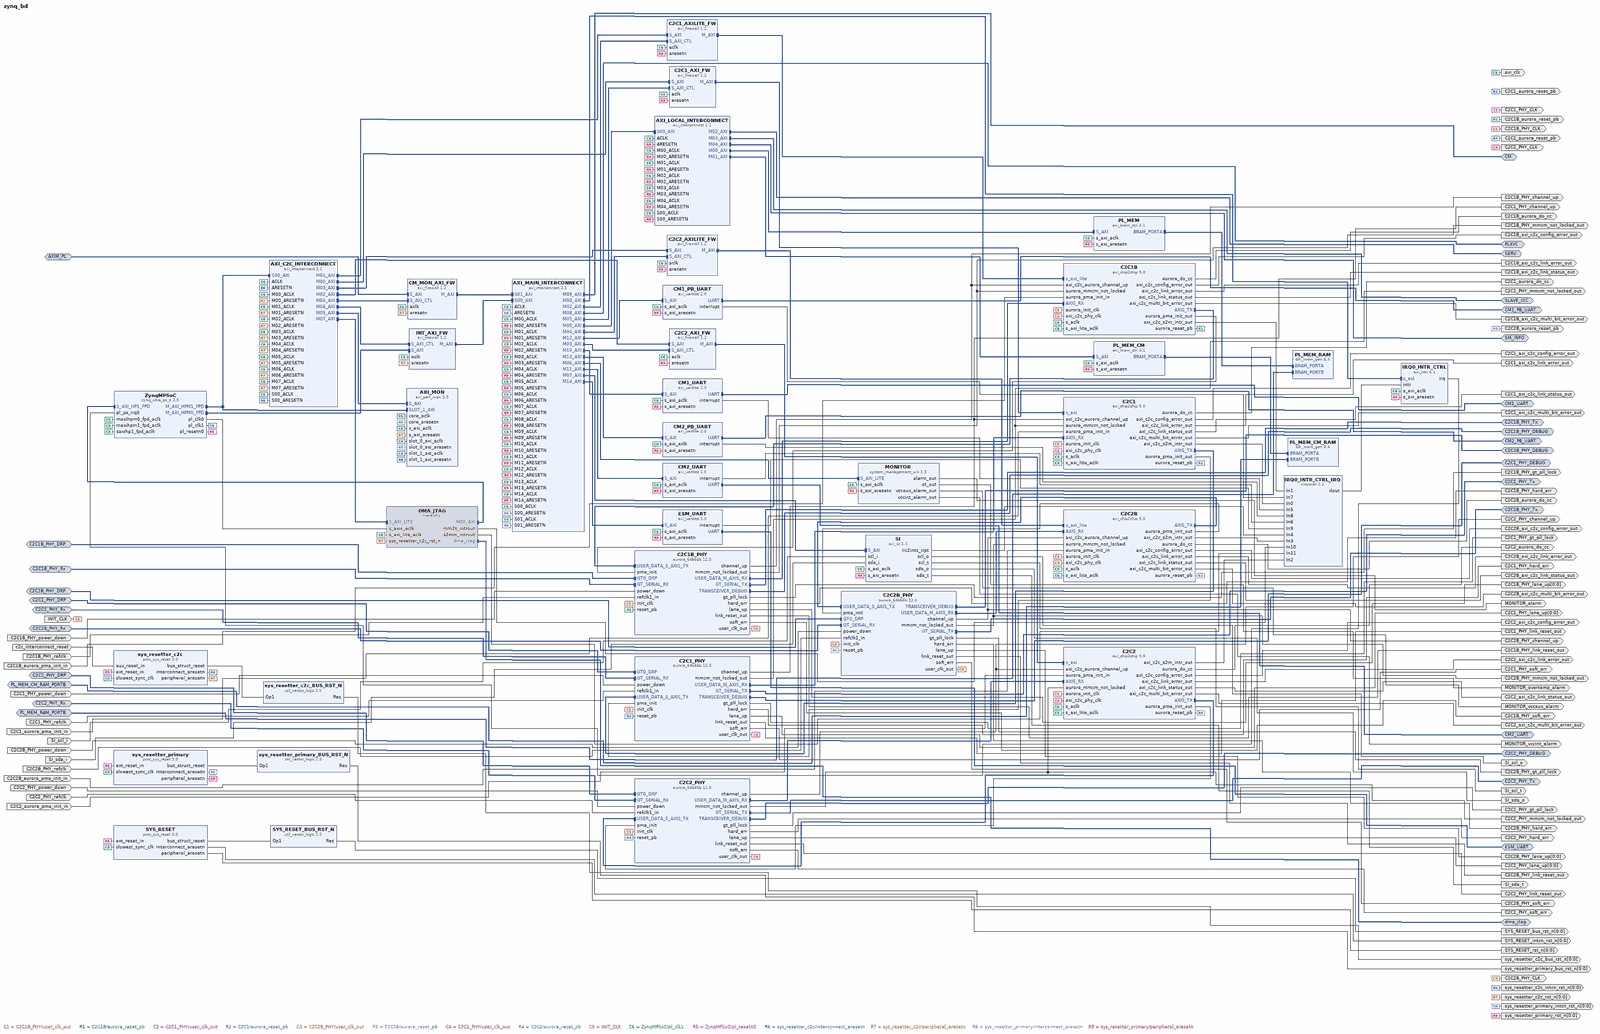
[diagram p0: block diagram of the top level, whole]
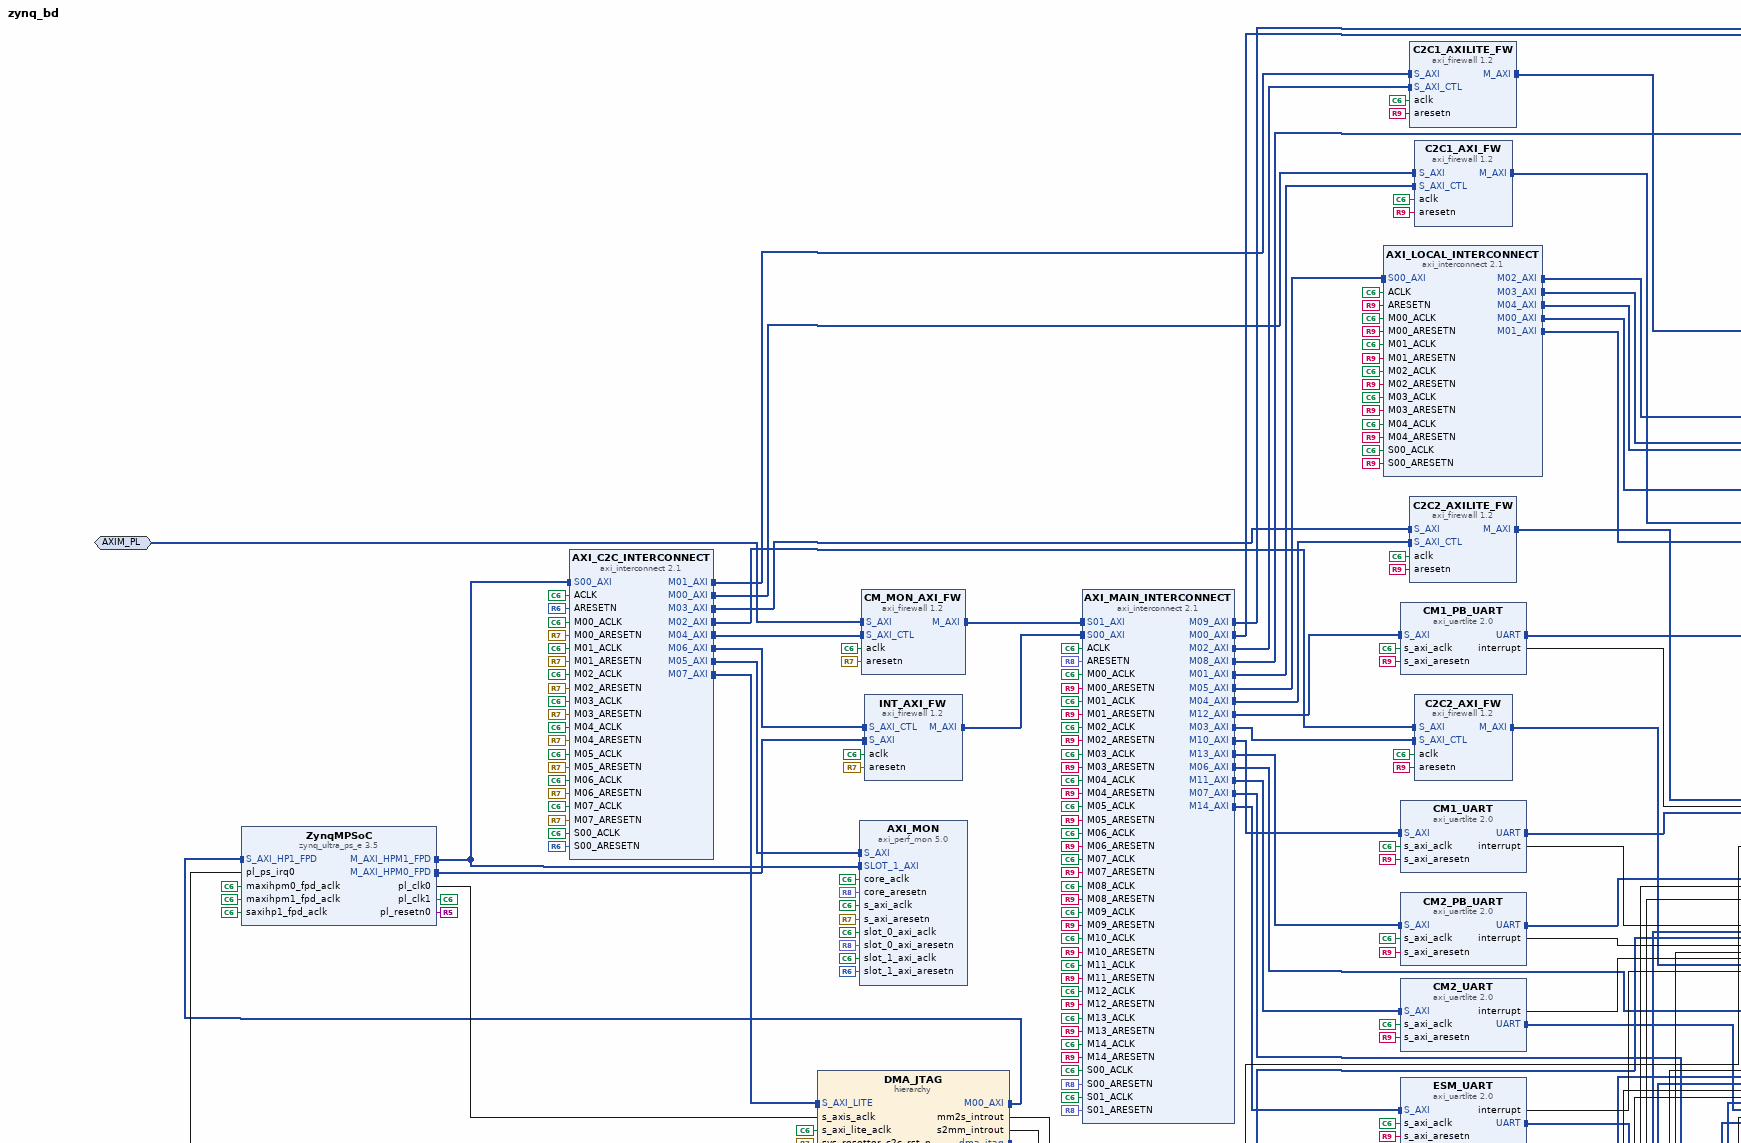
[diagram p1: block diagram of the top level, upper left part]
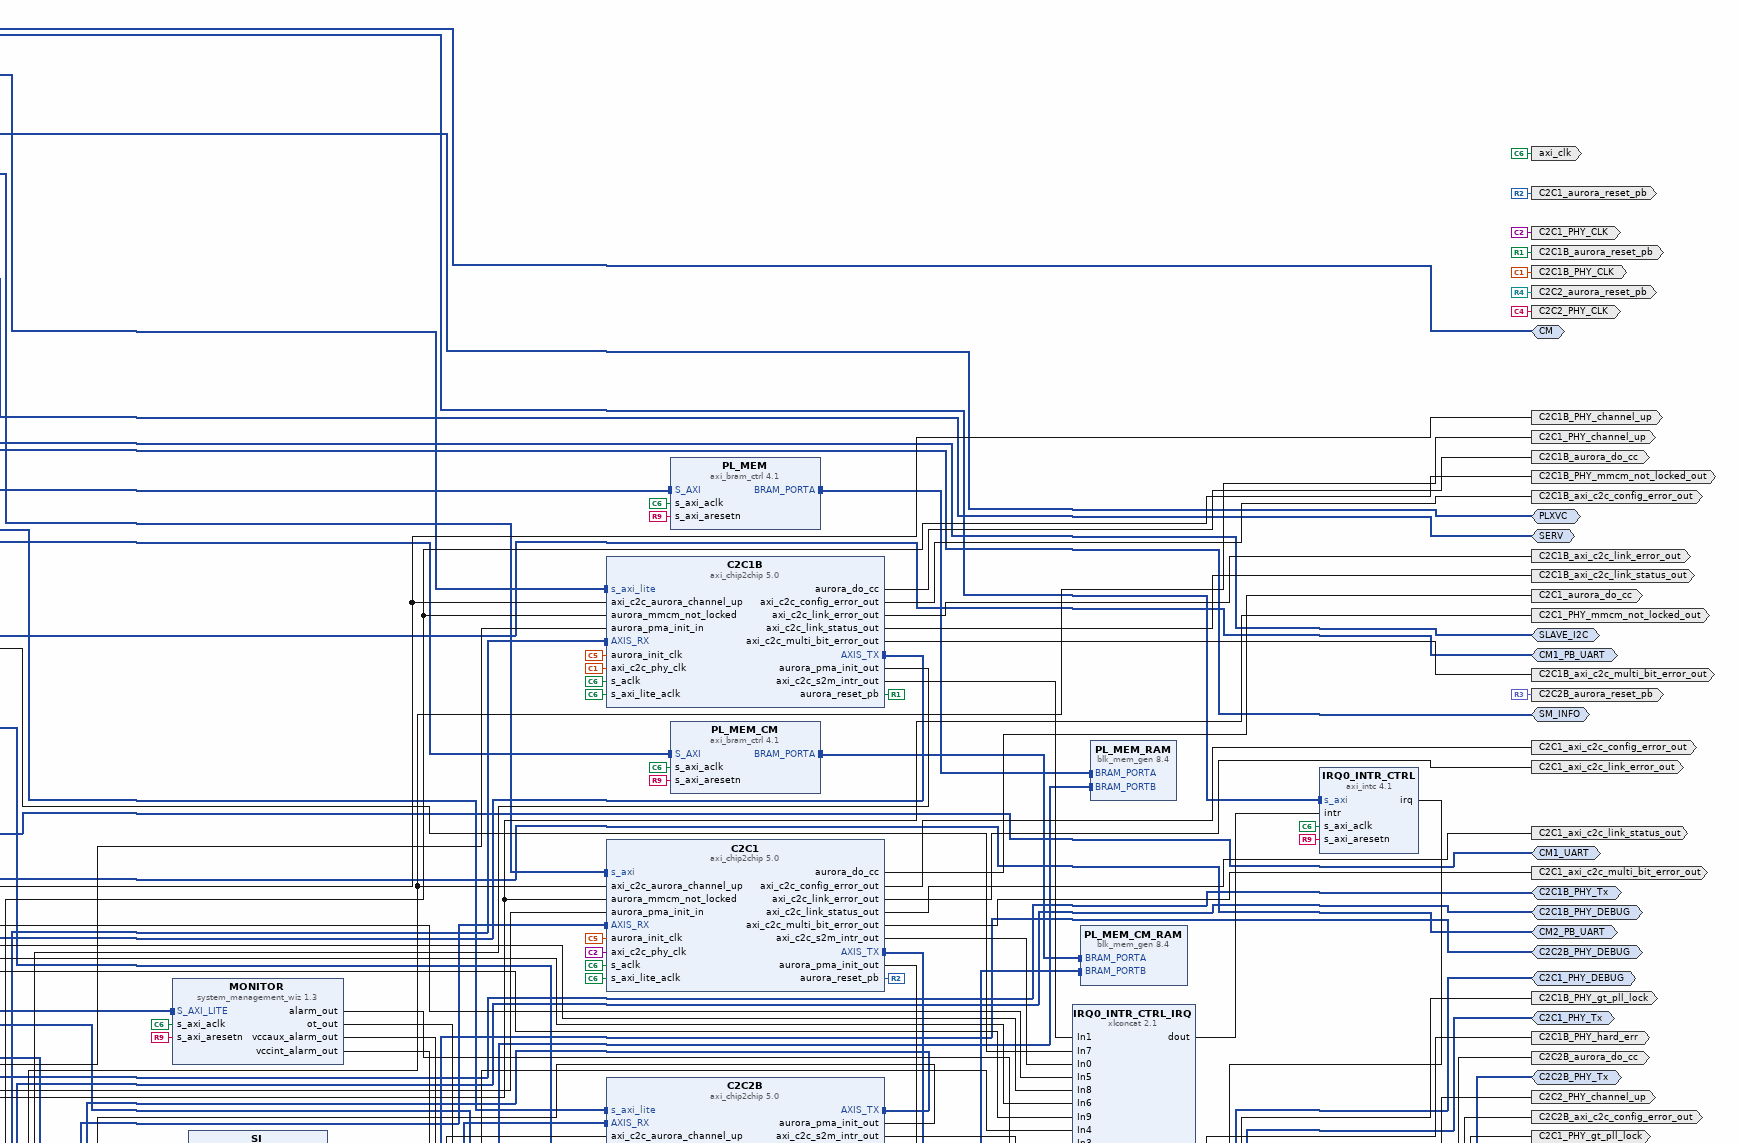
[diagram p2: block diagram of the top level, upper right part]
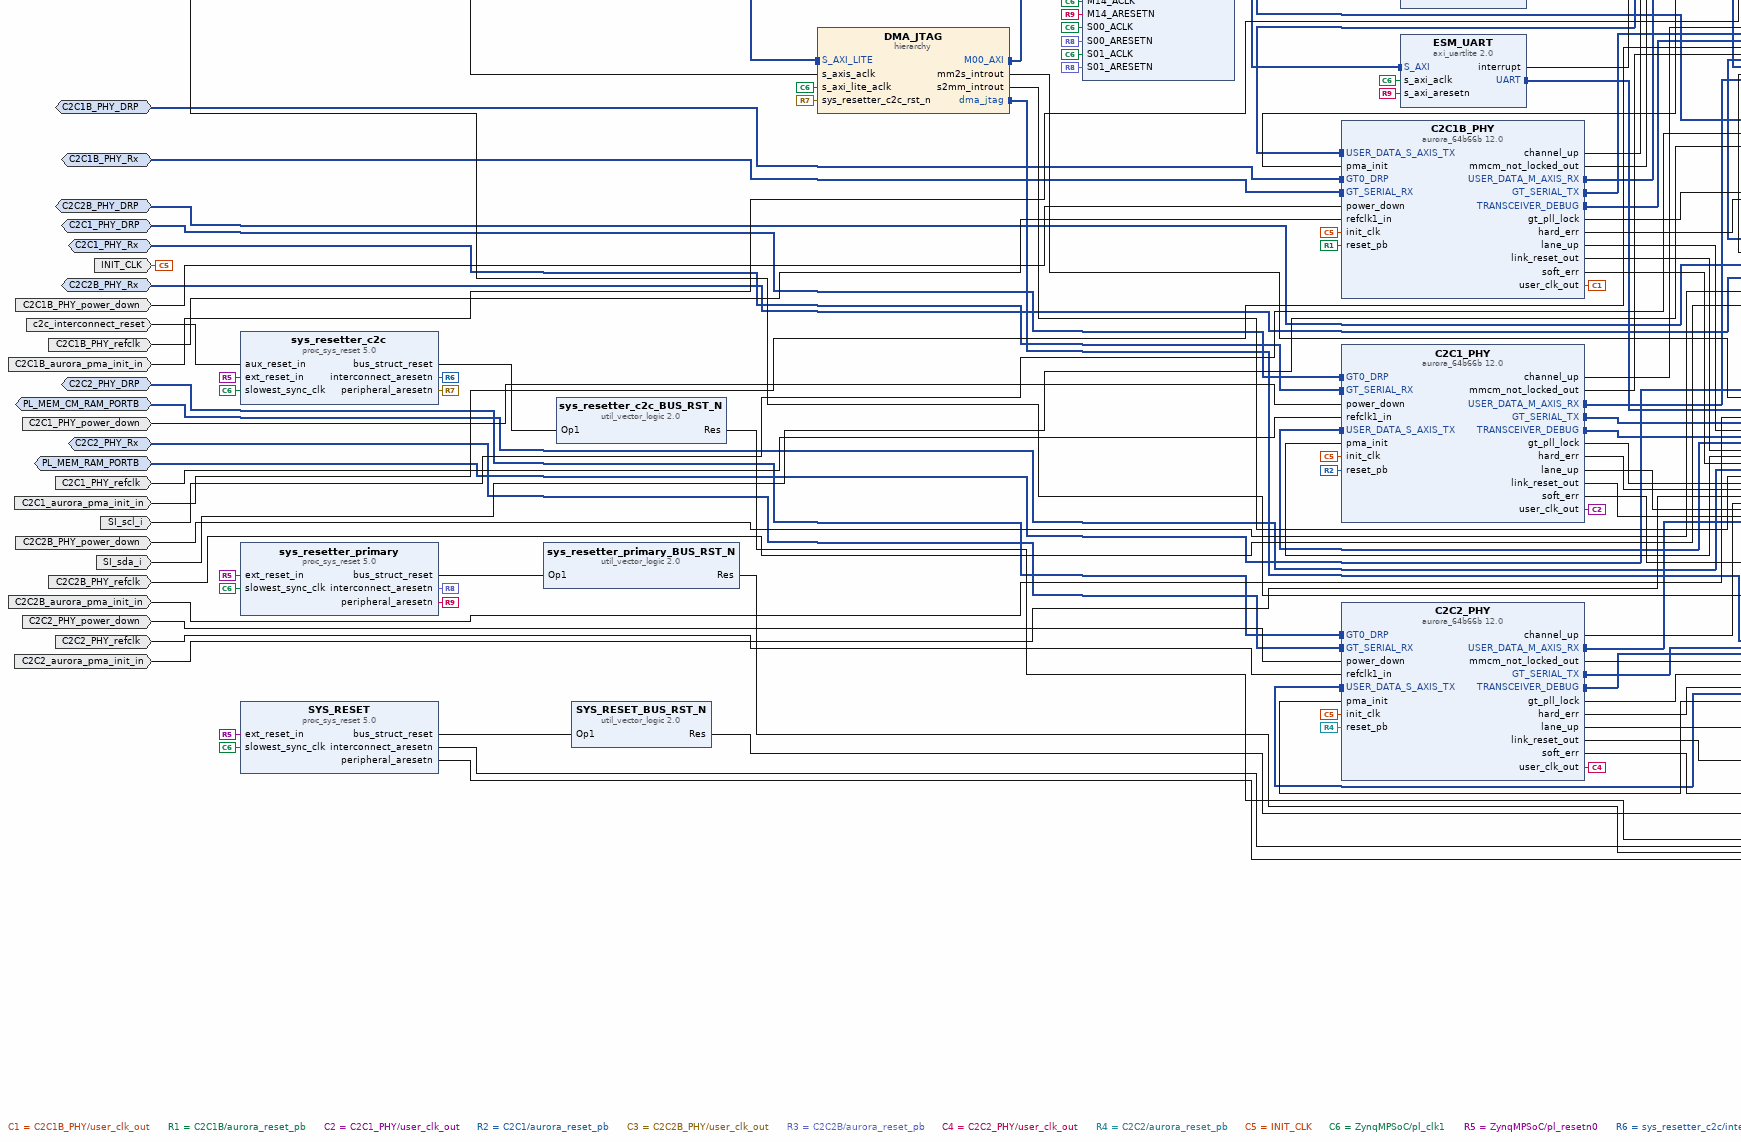
[diagram p3: block diagram of the top level, lower left part]
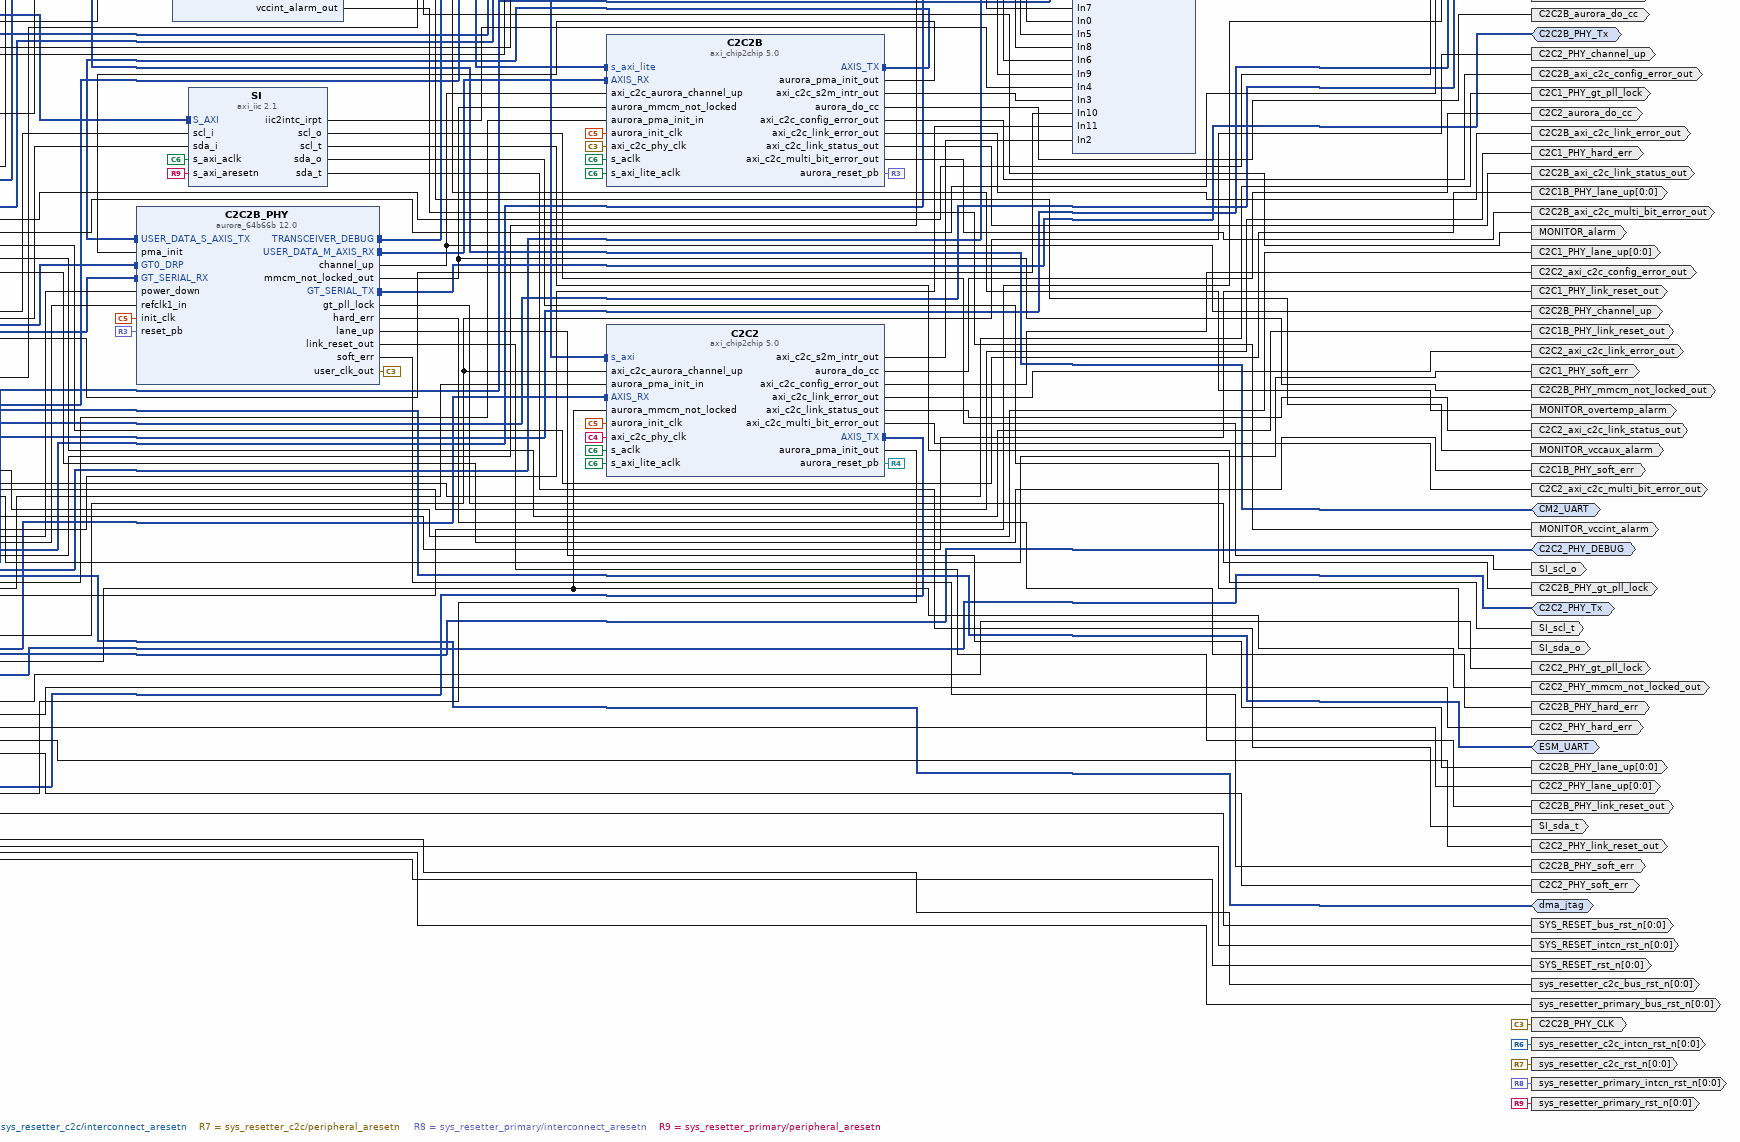
[diagram p4: block diagram of the top level, lower right part]
# Vivado block design zynq_bd, xczu7ev-fbvb900-2-i, Vivado 2023.2
create_bd_design zynq_bd

create_bd_intf_port -mode Slave -vlnv xilinx.com:interface:aximm_rtl:1.0 AXIM_PL
set_property -dict [list \
  CONFIG.ADDR_WIDTH 32 \
  CONFIG.ARUSER_WIDTH 0 \
  CONFIG.AWUSER_WIDTH 0 \
  CONFIG.BUSER_WIDTH 0 \
  CONFIG.DATA_WIDTH 32 \
  CONFIG.FREQ_HZ 49999500 \
  CONFIG.HAS_BRESP 1 \
  CONFIG.HAS_BURST 1 \
  CONFIG.HAS_CACHE 1 \
  CONFIG.HAS_LOCK 1 \
  CONFIG.HAS_PROT 1 \
  CONFIG.HAS_QOS 1 \
  CONFIG.HAS_REGION 1 \
  CONFIG.HAS_RRESP 1 \
  CONFIG.HAS_WSTRB 1 \
  CONFIG.ID_WIDTH 0 \
  CONFIG.MAX_BURST_LENGTH 1 \
  CONFIG.NUM_READ_OUTSTANDING 1 \
  CONFIG.NUM_READ_THREADS 1 \
  CONFIG.NUM_WRITE_OUTSTANDING 1 \
  CONFIG.NUM_WRITE_THREADS 1 \
  CONFIG.PROTOCOL AXI4LITE \
  CONFIG.READ_WRITE_MODE READ_WRITE \
  CONFIG.RUSER_BITS_PER_BYTE 0 \
  CONFIG.RUSER_WIDTH 0 \
  CONFIG.SUPPORTS_NARROW_BURST 0 \
  CONFIG.WUSER_BITS_PER_BYTE 0 \
  CONFIG.WUSER_WIDTH 0 \
] [get_bd_intf_ports AXIM_PL]
create_bd_intf_port -mode Slave -vlnv xilinx.com:interface:drp_rtl:1.0 C2C1_PHY_DRP
create_bd_intf_port -mode Slave -vlnv xilinx.com:display_aurora:GT_Serial_Transceiver_Pins_RX_rtl:1.0 C2C1_PHY_Rx
create_bd_intf_port -mode Master -vlnv xilinx.com:display_aurora:GT_Serial_Transceiver_Pins_TX_rtl:1.0 C2C1_PHY_Tx
create_bd_intf_port -mode Master -vlnv xilinx.com:display_aurora:transceiver_debug_rtl:1.0 C2C1_PHY_DEBUG
create_bd_intf_port -mode Slave -vlnv xilinx.com:interface:drp_rtl:1.0 C2C1B_PHY_DRP
create_bd_intf_port -mode Slave -vlnv xilinx.com:display_aurora:GT_Serial_Transceiver_Pins_RX_rtl:1.0 C2C1B_PHY_Rx
create_bd_intf_port -mode Master -vlnv xilinx.com:display_aurora:GT_Serial_Transceiver_Pins_TX_rtl:1.0 C2C1B_PHY_Tx
create_bd_intf_port -mode Master -vlnv xilinx.com:display_aurora:transceiver_debug_rtl:1.0 C2C1B_PHY_DEBUG
create_bd_intf_port -mode Slave -vlnv xilinx.com:interface:drp_rtl:1.0 C2C2_PHY_DRP
create_bd_intf_port -mode Slave -vlnv xilinx.com:display_aurora:GT_Serial_Transceiver_Pins_RX_rtl:1.0 C2C2_PHY_Rx
create_bd_intf_port -mode Master -vlnv xilinx.com:display_aurora:GT_Serial_Transceiver_Pins_TX_rtl:1.0 C2C2_PHY_Tx
create_bd_intf_port -mode Master -vlnv xilinx.com:display_aurora:transceiver_debug_rtl:1.0 C2C2_PHY_DEBUG
create_bd_intf_port -mode Slave -vlnv xilinx.com:interface:drp_rtl:1.0 C2C2B_PHY_DRP
create_bd_intf_port -mode Slave -vlnv xilinx.com:display_aurora:GT_Serial_Transceiver_Pins_RX_rtl:1.0 C2C2B_PHY_Rx
create_bd_intf_port -mode Master -vlnv xilinx.com:display_aurora:GT_Serial_Transceiver_Pins_TX_rtl:1.0 C2C2B_PHY_Tx
create_bd_intf_port -mode Master -vlnv xilinx.com:display_aurora:transceiver_debug_rtl:1.0 C2C2B_PHY_DEBUG
create_bd_intf_port -mode Slave -vlnv xilinx.com:interface:bram_rtl:1.0 PL_MEM_RAM_PORTB
set_property -dict {CONFIG.MASTER_TYPE BRAM_CTRL} [get_bd_intf_ports PL_MEM_RAM_PORTB]
create_bd_intf_port -mode Slave -vlnv xilinx.com:interface:bram_rtl:1.0 PL_MEM_CM_RAM_PORTB
set_property -dict {CONFIG.MASTER_TYPE BRAM_CTRL} [get_bd_intf_ports PL_MEM_CM_RAM_PORTB]
create_bd_intf_port -mode Master -vlnv xilinx.com:interface:aximm_rtl:1.0 SERV
set_property -dict [list \
  CONFIG.ADDR_WIDTH 32 \
  CONFIG.DATA_WIDTH 32 \
  CONFIG.FREQ_HZ 49999500 \
  CONFIG.NUM_READ_OUTSTANDING 2 \
  CONFIG.NUM_WRITE_OUTSTANDING 2 \
  CONFIG.PROTOCOL AXI4LITE \
] [get_bd_intf_ports SERV]
create_bd_intf_port -mode Master -vlnv xilinx.com:interface:aximm_rtl:1.0 SLAVE_I2C
set_property -dict [list \
  CONFIG.ADDR_WIDTH 32 \
  CONFIG.DATA_WIDTH 32 \
  CONFIG.FREQ_HZ 49999500 \
  CONFIG.NUM_READ_OUTSTANDING 2 \
  CONFIG.NUM_WRITE_OUTSTANDING 2 \
  CONFIG.PROTOCOL AXI4LITE \
] [get_bd_intf_ports SLAVE_I2C]
create_bd_intf_port -mode Master -vlnv xilinx.com:interface:aximm_rtl:1.0 SM_INFO
set_property -dict [list \
  CONFIG.ADDR_WIDTH 32 \
  CONFIG.DATA_WIDTH 32 \
  CONFIG.FREQ_HZ 49999500 \
  CONFIG.NUM_READ_OUTSTANDING 2 \
  CONFIG.NUM_WRITE_OUTSTANDING 2 \
  CONFIG.PROTOCOL AXI4LITE \
] [get_bd_intf_ports SM_INFO]
create_bd_intf_port -mode Master -vlnv xilinx.com:interface:aximm_rtl:1.0 PLXVC
set_property -dict [list \
  CONFIG.ADDR_WIDTH 32 \
  CONFIG.DATA_WIDTH 32 \
  CONFIG.FREQ_HZ 49999500 \
  CONFIG.NUM_READ_OUTSTANDING 2 \
  CONFIG.NUM_WRITE_OUTSTANDING 2 \
  CONFIG.PROTOCOL AXI4LITE \
] [get_bd_intf_ports PLXVC]
create_bd_intf_port -mode Master -vlnv xilinx.com:interface:aximm_rtl:1.0 CM
set_property -dict [list \
  CONFIG.ADDR_WIDTH 32 \
  CONFIG.DATA_WIDTH 32 \
  CONFIG.FREQ_HZ 49999500 \
  CONFIG.NUM_READ_OUTSTANDING 2 \
  CONFIG.NUM_WRITE_OUTSTANDING 2 \
  CONFIG.PROTOCOL AXI4LITE \
] [get_bd_intf_ports CM]
create_bd_intf_port -mode Master -vlnv xilinx.com:interface:uart_rtl:1.0 CM1_UART
create_bd_intf_port -mode Master -vlnv xilinx.com:interface:uart_rtl:1.0 CM2_UART
create_bd_intf_port -mode Master -vlnv xilinx.com:interface:uart_rtl:1.0 CM1_PB_UART
create_bd_intf_port -mode Master -vlnv xilinx.com:interface:uart_rtl:1.0 CM2_PB_UART
create_bd_intf_port -mode Master -vlnv xilinx.com:interface:uart_rtl:1.0 ESM_UART
create_bd_intf_port -mode Master -vlnv xilinx.com:interface:jtag_rtl:2.0 dma_jtag
create_bd_port -dir O -type clk axi_clk
create_bd_port -dir O -from 0 -to 0 sys_resetter_primary_bus_rst_n
create_bd_port -dir O -from 0 -to 0 -type rst sys_resetter_primary_intcn_rst_n
create_bd_port -dir O -from 0 -to 0 -type rst sys_resetter_primary_rst_n
create_bd_port -dir I -type rst c2c_interconnect_reset
set_property -dict {CONFIG.POLARITY ACTIVE_HIGH} [get_bd_ports c2c_interconnect_reset]
create_bd_port -dir O -from 0 -to 0 sys_resetter_c2c_bus_rst_n
create_bd_port -dir O -from 0 -to 0 -type rst sys_resetter_c2c_intcn_rst_n
create_bd_port -dir O -from 0 -to 0 -type rst sys_resetter_c2c_rst_n
create_bd_port -dir I -type clk INIT_CLK
set_property -dict {CONFIG.FREQ_HZ 50000000} [get_bd_ports INIT_CLK]
create_bd_port -dir O -from 0 -to 0 SYS_RESET_bus_rst_n
create_bd_port -dir O -from 0 -to 0 -type rst SYS_RESET_intcn_rst_n
create_bd_port -dir O -from 0 -to 0 -type rst SYS_RESET_rst_n
create_bd_port -dir I -type rst C2C1_aurora_pma_init_in
set_property -dict {CONFIG.POLARITY ACTIVE_HIGH} [get_bd_ports C2C1_aurora_pma_init_in]
create_bd_port -dir O -type rst C2C1_aurora_reset_pb
create_bd_port -dir O C2C1_aurora_do_cc
create_bd_port -dir O C2C1_axi_c2c_config_error_out
create_bd_port -dir O C2C1_axi_c2c_link_status_out
create_bd_port -dir O C2C1_axi_c2c_multi_bit_error_out
create_bd_port -dir O C2C1_axi_c2c_link_error_out
create_bd_port -dir I -type clk C2C1_PHY_refclk
set_property -dict {CONFIG.PHASE 0} [get_bd_ports C2C1_PHY_refclk]
create_bd_port -dir I -type rst C2C1_PHY_power_down
create_bd_port -dir O C2C1_PHY_gt_pll_lock
create_bd_port -dir O C2C1_PHY_hard_err
create_bd_port -dir O C2C1_PHY_soft_err
create_bd_port -dir O -from 0 -to 0 C2C1_PHY_lane_up
create_bd_port -dir O C2C1_PHY_mmcm_not_locked_out
create_bd_port -dir O -type rst C2C1_PHY_link_reset_out
create_bd_port -dir O C2C1_PHY_channel_up
create_bd_port -dir O -type clk C2C1_PHY_CLK
create_bd_port -dir I -type rst C2C1B_aurora_pma_init_in
set_property -dict {CONFIG.POLARITY ACTIVE_HIGH} [get_bd_ports C2C1B_aurora_pma_init_in]
create_bd_port -dir O -type rst C2C1B_aurora_reset_pb
create_bd_port -dir O C2C1B_aurora_do_cc
create_bd_port -dir O C2C1B_axi_c2c_config_error_out
create_bd_port -dir O C2C1B_axi_c2c_link_status_out
create_bd_port -dir O C2C1B_axi_c2c_multi_bit_error_out
create_bd_port -dir O C2C1B_axi_c2c_link_error_out
create_bd_port -dir I -type clk C2C1B_PHY_refclk
set_property -dict {CONFIG.PHASE 0} [get_bd_ports C2C1B_PHY_refclk]
create_bd_port -dir I -type rst C2C1B_PHY_power_down
create_bd_port -dir O C2C1B_PHY_gt_pll_lock
create_bd_port -dir O C2C1B_PHY_hard_err
create_bd_port -dir O C2C1B_PHY_soft_err
create_bd_port -dir O -from 0 -to 0 C2C1B_PHY_lane_up
create_bd_port -dir O C2C1B_PHY_mmcm_not_locked_out
create_bd_port -dir O -type rst C2C1B_PHY_link_reset_out
create_bd_port -dir O C2C1B_PHY_channel_up
create_bd_port -dir O -type clk C2C1B_PHY_CLK
create_bd_port -dir I -type rst C2C2_aurora_pma_init_in
set_property -dict {CONFIG.POLARITY ACTIVE_HIGH} [get_bd_ports C2C2_aurora_pma_init_in]
create_bd_port -dir O -type rst C2C2_aurora_reset_pb
create_bd_port -dir O C2C2_aurora_do_cc
create_bd_port -dir O C2C2_axi_c2c_config_error_out
create_bd_port -dir O C2C2_axi_c2c_link_status_out
create_bd_port -dir O C2C2_axi_c2c_multi_bit_error_out
create_bd_port -dir O C2C2_axi_c2c_link_error_out
create_bd_port -dir I -type clk C2C2_PHY_refclk
set_property -dict {CONFIG.PHASE 0} [get_bd_ports C2C2_PHY_refclk]
create_bd_port -dir I -type rst C2C2_PHY_power_down
create_bd_port -dir O C2C2_PHY_gt_pll_lock
create_bd_port -dir O C2C2_PHY_hard_err
create_bd_port -dir O C2C2_PHY_soft_err
create_bd_port -dir O -from 0 -to 0 C2C2_PHY_lane_up
create_bd_port -dir O C2C2_PHY_mmcm_not_locked_out
create_bd_port -dir O -type rst C2C2_PHY_link_reset_out
create_bd_port -dir O C2C2_PHY_channel_up
create_bd_port -dir O -type clk C2C2_PHY_CLK
create_bd_port -dir I -type rst C2C2B_aurora_pma_init_in
set_property -dict {CONFIG.POLARITY ACTIVE_HIGH} [get_bd_ports C2C2B_aurora_pma_init_in]
create_bd_port -dir O -type rst C2C2B_aurora_reset_pb
create_bd_port -dir O C2C2B_aurora_do_cc
create_bd_port -dir O C2C2B_axi_c2c_config_error_out
create_bd_port -dir O C2C2B_axi_c2c_link_status_out
create_bd_port -dir O C2C2B_axi_c2c_multi_bit_error_out
create_bd_port -dir O C2C2B_axi_c2c_link_error_out
create_bd_port -dir I -type clk C2C2B_PHY_refclk
set_property -dict {CONFIG.PHASE 0} [get_bd_ports C2C2B_PHY_refclk]
create_bd_port -dir I -type rst C2C2B_PHY_power_down
create_bd_port -dir O C2C2B_PHY_gt_pll_lock
create_bd_port -dir O C2C2B_PHY_hard_err
create_bd_port -dir O C2C2B_PHY_soft_err
create_bd_port -dir O -from 0 -to 0 C2C2B_PHY_lane_up
create_bd_port -dir O C2C2B_PHY_mmcm_not_locked_out
create_bd_port -dir O -type rst C2C2B_PHY_link_reset_out
create_bd_port -dir O C2C2B_PHY_channel_up
create_bd_port -dir O -type clk C2C2B_PHY_CLK
create_bd_port -dir O MONITOR_alarm
create_bd_port -dir O MONITOR_vccint_alarm
create_bd_port -dir O MONITOR_vccaux_alarm
create_bd_port -dir O MONITOR_overtemp_alarm
create_bd_port -dir I SI_scl_i
create_bd_port -dir I SI_sda_i
create_bd_port -dir O SI_sda_o
create_bd_port -dir O SI_scl_o
create_bd_port -dir O SI_scl_t
create_bd_port -dir O SI_sda_t

create_bd_cell -type ip -vlnv xilinx.com:ip:zynq_ultra_ps_e:3.5 ZynqMPSoC
set_property -dict [list \
  CONFIG.CAN0_BOARD_INTERFACE custom \
  CONFIG.CAN1_BOARD_INTERFACE custom \
  CONFIG.CSU_BOARD_INTERFACE custom \
  CONFIG.DP_BOARD_INTERFACE custom \
  CONFIG.GEM0_BOARD_INTERFACE custom \
  CONFIG.GEM1_BOARD_INTERFACE custom \
  CONFIG.GEM2_BOARD_INTERFACE custom \
  CONFIG.GEM3_BOARD_INTERFACE custom \
  CONFIG.GPIO_BOARD_INTERFACE custom \
  CONFIG.IIC0_BOARD_INTERFACE custom \
  CONFIG.IIC1_BOARD_INTERFACE custom \
  CONFIG.NAND_BOARD_INTERFACE custom \
  CONFIG.PCIE_BOARD_INTERFACE custom \
  CONFIG.PJTAG_BOARD_INTERFACE custom \
  CONFIG.PMU_BOARD_INTERFACE custom \
  CONFIG.PSU_BANK_0_IO_STANDARD LVCMOS18 \
  CONFIG.PSU_BANK_1_IO_STANDARD LVCMOS33 \
  CONFIG.PSU_BANK_2_IO_STANDARD LVCMOS18 \
  CONFIG.PSU_BANK_3_IO_STANDARD LVCMOS33 \
  CONFIG.PSU_USB3__DUAL_CLOCK_ENABLE 0 \
  CONFIG.PSU__CAN1__PERIPHERAL__ENABLE 0 \
  CONFIG.PSU__CRF_APB__ACPU_CTRL__FREQMHZ 1200 \
  CONFIG.PSU__CRF_APB__ACPU_CTRL__SRCSEL APLL \
  CONFIG.PSU__CRF_APB__APLL_CTRL__SRCSEL PSS_REF_CLK \
  CONFIG.PSU__CRF_APB__DBG_FPD_CTRL__FREQMHZ 250 \
  CONFIG.PSU__CRF_APB__DBG_FPD_CTRL__SRCSEL IOPLL \
  CONFIG.PSU__CRF_APB__DBG_TRACE_CTRL__FREQMHZ 250 \
  CONFIG.PSU__CRF_APB__DBG_TRACE_CTRL__SRCSEL IOPLL \
  CONFIG.PSU__CRF_APB__DBG_TSTMP_CTRL__FREQMHZ 250 \
  CONFIG.PSU__CRF_APB__DBG_TSTMP_CTRL__SRCSEL IOPLL \
  CONFIG.PSU__CRF_APB__DDR_CTRL__FREQMHZ 1200 \
  CONFIG.PSU__CRF_APB__DDR_CTRL__SRCSEL DPLL \
  CONFIG.PSU__CRF_APB__DPDMA_REF_CTRL__FREQMHZ 600 \
  CONFIG.PSU__CRF_APB__DPDMA_REF_CTRL__SRCSEL DPLL \
  CONFIG.PSU__CRF_APB__DPLL_CTRL__SRCSEL PSS_REF_CLK \
  CONFIG.PSU__CRF_APB__DP_AUDIO_REF_CTRL__SRCSEL VPLL \
  CONFIG.PSU__CRF_APB__DP_STC_REF_CTRL__SRCSEL VPLL \
  CONFIG.PSU__CRF_APB__DP_VIDEO_REF_CTRL__SRCSEL DPLL \
  CONFIG.PSU__CRF_APB__GDMA_REF_CTRL__FREQMHZ 600 \
  CONFIG.PSU__CRF_APB__GDMA_REF_CTRL__SRCSEL DPLL \
  CONFIG.PSU__CRF_APB__GPU_REF_CTRL__FREQMHZ 600 \
  CONFIG.PSU__CRF_APB__GPU_REF_CTRL__SRCSEL DPLL \
  CONFIG.PSU__CRF_APB__TOPSW_LSBUS_CTRL__FREQMHZ 100 \
  CONFIG.PSU__CRF_APB__TOPSW_LSBUS_CTRL__SRCSEL IOPLL \
  CONFIG.PSU__CRF_APB__TOPSW_MAIN_CTRL__FREQMHZ 500 \
  CONFIG.PSU__CRF_APB__TOPSW_MAIN_CTRL__SRCSEL VPLL \
  CONFIG.PSU__CRF_APB__VPLL_CTRL__SRCSEL PSS_REF_CLK \
  CONFIG.PSU__CRL_APB__ADMA_REF_CTRL__FREQMHZ 500 \
  CONFIG.PSU__CRL_APB__ADMA_REF_CTRL__SRCSEL RPLL \
  CONFIG.PSU__CRL_APB__CAN1_REF_CTRL__FREQMHZ 100 \
  CONFIG.PSU__CRL_APB__CAN1_REF_CTRL__SRCSEL IOPLL \
  CONFIG.PSU__CRL_APB__CPU_R5_CTRL__FREQMHZ 500 \
  CONFIG.PSU__CRL_APB__CPU_R5_CTRL__SRCSEL RPLL \
  CONFIG.PSU__CRL_APB__DBG_LPD_CTRL__FREQMHZ 250 \
  CONFIG.PSU__CRL_APB__DBG_LPD_CTRL__SRCSEL IOPLL \
  CONFIG.PSU__CRL_APB__GEM3_REF_CTRL__FREQMHZ 125 \
  CONFIG.PSU__CRL_APB__GEM3_REF_CTRL__SRCSEL IOPLL \
  CONFIG.PSU__CRL_APB__I2C0_REF_CTRL__FREQMHZ 100 \
  CONFIG.PSU__CRL_APB__I2C0_REF_CTRL__SRCSEL IOPLL \
  CONFIG.PSU__CRL_APB__I2C1_REF_CTRL__FREQMHZ 100 \
  CONFIG.PSU__CRL_APB__I2C1_REF_CTRL__SRCSEL IOPLL \
  CONFIG.PSU__CRL_APB__IOPLL_CTRL__SRCSEL PSS_REF_CLK \
  CONFIG.PSU__CRL_APB__IOU_SWITCH_CTRL__FREQMHZ 250 \
  CONFIG.PSU__CRL_APB__IOU_SWITCH_CTRL__SRCSEL RPLL \
  CONFIG.PSU__CRL_APB__LPD_LSBUS_CTRL__FREQMHZ 100 \
  CONFIG.PSU__CRL_APB__LPD_LSBUS_CTRL__SRCSEL IOPLL \
  CONFIG.PSU__CRL_APB__LPD_SWITCH_CTRL__FREQMHZ 500 \
  CONFIG.PSU__CRL_APB__LPD_SWITCH_CTRL__SRCSEL RPLL \
  CONFIG.PSU__CRL_APB__PCAP_CTRL__FREQMHZ 200 \
  CONFIG.PSU__CRL_APB__PCAP_CTRL__SRCSEL IOPLL \
  CONFIG.PSU__CRL_APB__PL0_REF_CTRL__FREQMHZ 80 \
  CONFIG.PSU__CRL_APB__PL0_REF_CTRL__SRCSEL DPLL \
  CONFIG.PSU__CRL_APB__PL1_REF_CTRL__FREQMHZ 50 \
  CONFIG.PSU__CRL_APB__QSPI_REF_CTRL__FREQMHZ 50 \
  CONFIG.PSU__CRL_APB__QSPI_REF_CTRL__SRCSEL IOPLL \
  CONFIG.PSU__CRL_APB__RPLL_CTRL__SRCSEL PSS_REF_CLK \
  CONFIG.PSU__CRL_APB__SDIO1_REF_CTRL__FREQMHZ 50 \
  CONFIG.PSU__CRL_APB__SDIO1_REF_CTRL__SRCSEL IOPLL \
  CONFIG.PSU__CRL_APB__TIMESTAMP_REF_CTRL__FREQMHZ 100 \
  CONFIG.PSU__CRL_APB__TIMESTAMP_REF_CTRL__SRCSEL PSS_REF_CLK \
  CONFIG.PSU__CRL_APB__UART0_REF_CTRL__FREQMHZ 100 \
  CONFIG.PSU__CRL_APB__UART0_REF_CTRL__SRCSEL IOPLL \
  CONFIG.PSU__CRL_APB__UART1_REF_CTRL__FREQMHZ 100 \
  CONFIG.PSU__CRL_APB__UART1_REF_CTRL__SRCSEL IOPLL \
  CONFIG.PSU__CRL_APB__USB0_BUS_REF_CTRL__FREQMHZ 250 \
  CONFIG.PSU__CRL_APB__USB0_BUS_REF_CTRL__SRCSEL IOPLL \
  CONFIG.PSU__CRL_APB__USB3_DUAL_REF_CTRL__FREQMHZ 20 \
  CONFIG.PSU__CRL_APB__USB3_DUAL_REF_CTRL__SRCSEL IOPLL \
  CONFIG.PSU__CRL_APB__USB3__ENABLE 0 \
  CONFIG.PSU__CSUPMU__PERIPHERAL__VALID 0 \
  CONFIG.PSU__DDRC__BUS_WIDTH {64 Bit} \
  CONFIG.PSU__DDRC__COMPONENTS Components \
  CONFIG.PSU__DDRC__DEVICE_CAPACITY {8192 MBits} \
  CONFIG.PSU__DDRC__DRAM_WIDTH {16 Bits} \
  CONFIG.PSU__DDRC__ECC Enabled \
  CONFIG.PSU__DDRC__MEMORY_TYPE {DDR 4} \
  CONFIG.PSU__DDRC__SPEED_BIN DDR4_2400T \
  CONFIG.PSU__DDR_HIGH_ADDRESS_GUI_ENABLE 1 \
  CONFIG.PSU__DDR__INTERFACE__FREQMHZ 600.000 \
  CONFIG.PSU__DEVICE_TYPE EV \
  CONFIG.PSU__DISPLAYPORT__PERIPHERAL__ENABLE 0 \
  CONFIG.PSU__DLL__ISUSED 1 \
  CONFIG.PSU__ENET0__GRP_MDIO__ENABLE 1 \
  CONFIG.PSU__ENET0__GRP_MDIO__IO {MIO 76 .. 77} \
  CONFIG.PSU__ENET0__PERIPHERAL__ENABLE 1 \
  CONFIG.PSU__ENET0__PERIPHERAL__IO {MIO 26 .. 37} \
  CONFIG.PSU__ENET3__FIFO__ENABLE 0 \
  CONFIG.PSU__ENET3__GRP_MDIO__ENABLE 0 \
  CONFIG.PSU__ENET3__PERIPHERAL__ENABLE 1 \
  CONFIG.PSU__ENET3__PERIPHERAL__IO {MIO 64 .. 75} \
  CONFIG.PSU__ENET3__PTP__ENABLE 0 \
  CONFIG.PSU__ENET3__TSU__ENABLE 0 \
  CONFIG.PSU__FPD_SLCR__WDT1__FREQMHZ 100 \
  CONFIG.PSU__FPGA_PL0_ENABLE 1 \
  CONFIG.PSU__FPGA_PL1_ENABLE 1 \
  CONFIG.PSU__GEM3_COHERENCY 0 \
  CONFIG.PSU__GEM3_ROUTE_THROUGH_FPD 0 \
  CONFIG.PSU__GEM__TSU__ENABLE 0 \
  CONFIG.PSU__GPIO0_MIO__IO {MIO 0 .. 25} \
  CONFIG.PSU__GPIO0_MIO__PERIPHERAL__ENABLE 1 \
  CONFIG.PSU__GPIO1_MIO__IO {MIO 26 .. 51} \
  CONFIG.PSU__GPIO1_MIO__PERIPHERAL__ENABLE 1 \
  CONFIG.PSU__I2C0__PERIPHERAL__ENABLE 1 \
  CONFIG.PSU__I2C0__PERIPHERAL__IO {MIO 10 .. 11} \
  CONFIG.PSU__I2C1__PERIPHERAL__ENABLE 0 \
  CONFIG.PSU__IOU_SLCR__IOU_TTC_APB_CLK__TTC0_SEL APB \
  CONFIG.PSU__IOU_SLCR__IOU_TTC_APB_CLK__TTC1_SEL APB \
  CONFIG.PSU__IOU_SLCR__IOU_TTC_APB_CLK__TTC2_SEL APB \
  CONFIG.PSU__IOU_SLCR__IOU_TTC_APB_CLK__TTC3_SEL APB \
  CONFIG.PSU__IOU_SLCR__TTC1__FREQMHZ 100 \
  CONFIG.PSU__IOU_SLCR__TTC2__FREQMHZ 100 \
  CONFIG.PSU__IOU_SLCR__TTC3__FREQMHZ 100 \
  CONFIG.PSU__IOU_SLCR__WDT0__FREQMHZ 100 \
  CONFIG.PSU__LPD_SLCR__CSUPMU__FREQMHZ 100 \
  CONFIG.PSU__MAXIGP0__DATA_WIDTH 32 \
  CONFIG.PSU__MAXIGP1__DATA_WIDTH 32 \
  CONFIG.PSU__OVERRIDE_HPX_QOS 0 \
  CONFIG.PSU__OVERRIDE__BASIC_CLOCK 0 \
  CONFIG.PSU__PMU__PERIPHERAL__ENABLE 0 \
  CONFIG.PSU__PRESET_APPLIED 0 \
  CONFIG.PSU__PSS_REF_CLK__FREQMHZ 33.333 \
  CONFIG.PSU__QSPI_COHERENCY 0 \
  CONFIG.PSU__QSPI_ROUTE_THROUGH_FPD 0 \
  CONFIG.PSU__QSPI__GRP_FBCLK__ENABLE 1 \
  CONFIG.PSU__QSPI__GRP_FBCLK__IO {MIO 6} \
  CONFIG.PSU__QSPI__PERIPHERAL__DATA_MODE x4 \
  CONFIG.PSU__QSPI__PERIPHERAL__ENABLE 1 \
  CONFIG.PSU__QSPI__PERIPHERAL__IO {MIO 0 .. 5} \
  CONFIG.PSU__QSPI__PERIPHERAL__MODE Single \
  CONFIG.PSU__SATA__LANE0__ENABLE 1 \
  CONFIG.PSU__SATA__LANE0__IO {GT Lane2} \
  CONFIG.PSU__SATA__LANE1__ENABLE 0 \
  CONFIG.PSU__SATA__PERIPHERAL__ENABLE 1 \
  CONFIG.PSU__SATA__REF_CLK_FREQ 125 \
  CONFIG.PSU__SATA__REF_CLK_SEL {Ref Clk0} \
  CONFIG.PSU__SD0__CLK_200_SDR_OTAP_DLY 0x3 \
  CONFIG.PSU__SD0__CLK_50_DDR_ITAP_DLY 0x12 \
  CONFIG.PSU__SD0__CLK_50_DDR_OTAP_DLY 0x6 \
  CONFIG.PSU__SD0__CLK_50_SDR_ITAP_DLY 0x15 \
  CONFIG.PSU__SD0__CLK_50_SDR_OTAP_DLY 0x6 \
  CONFIG.PSU__SD0__DATA_TRANSFER_MODE 8Bit \
  CONFIG.PSU__SD0__PERIPHERAL__ENABLE 1 \
  CONFIG.PSU__SD0__PERIPHERAL__IO {MIO 13 .. 22} \
  CONFIG.PSU__SD0__SLOT_TYPE eMMC \
  CONFIG.PSU__SD1_COHERENCY 0 \
  CONFIG.PSU__SD1_ROUTE_THROUGH_FPD 0 \
  CONFIG.PSU__SD1__CLK_50_SDR_ITAP_DLY 0x15 \
  CONFIG.PSU__SD1__CLK_50_SDR_OTAP_DLY 0x5 \
  CONFIG.PSU__SD1__DATA_TRANSFER_MODE 4Bit \
  CONFIG.PSU__SD1__GRP_CD__ENABLE 0 \
  CONFIG.PSU__SD1__GRP_POW__ENABLE 0 \
  CONFIG.PSU__SD1__GRP_WP__ENABLE 0 \
  CONFIG.PSU__SD1__PERIPHERAL__ENABLE 1 \
  CONFIG.PSU__SD1__PERIPHERAL__IO {MIO 46 .. 51} \
  CONFIG.PSU__SD1__SLOT_TYPE {SD 2.0} \
  CONFIG.PSU__SWDT0__PERIPHERAL__ENABLE 0 \
  CONFIG.PSU__SWDT1__PERIPHERAL__ENABLE 0 \
  CONFIG.PSU__TSU__BUFG_PORT_PAIR 0 \
  CONFIG.PSU__TTC0__CLOCK__ENABLE 0 \
  CONFIG.PSU__TTC0__PERIPHERAL__ENABLE 1 \
  CONFIG.PSU__TTC0__WAVEOUT__ENABLE 0 \
  CONFIG.PSU__TTC1__PERIPHERAL__ENABLE 0 \
  CONFIG.PSU__TTC2__PERIPHERAL__ENABLE 0 \
  CONFIG.PSU__TTC3__PERIPHERAL__ENABLE 0 \
  CONFIG.PSU__UART0__BAUD_RATE 115200 \
  CONFIG.PSU__UART0__MODEM__ENABLE 0 \
  CONFIG.PSU__UART0__PERIPHERAL__ENABLE 1 \
  CONFIG.PSU__UART0__PERIPHERAL__IO {MIO 38 .. 39} \
  CONFIG.PSU__UART1__PERIPHERAL__ENABLE 0 \
  CONFIG.PSU__USB0__PERIPHERAL__ENABLE 0 \
  CONFIG.PSU__USE__IRQ0 1 \
  CONFIG.PSU__USE__M_AXI_GP0 1 \
  CONFIG.PSU__USE__M_AXI_GP1 1 \
  CONFIG.PSU__USE__M_AXI_GP2 0 \
  CONFIG.PSU__USE__S_AXI_GP3 1 \
  CONFIG.QSPI_BOARD_INTERFACE custom \
  CONFIG.SATA_BOARD_INTERFACE custom \
  CONFIG.SD0_BOARD_INTERFACE custom \
  CONFIG.SD1_BOARD_INTERFACE custom \
  CONFIG.SPI0_BOARD_INTERFACE custom \
  CONFIG.SPI1_BOARD_INTERFACE custom \
  CONFIG.SUBPRESET1 Custom \
  CONFIG.SUBPRESET2 Custom \
  CONFIG.SWDT0_BOARD_INTERFACE custom \
  CONFIG.SWDT1_BOARD_INTERFACE custom \
  CONFIG.TRACE_BOARD_INTERFACE custom \
  CONFIG.TTC0_BOARD_INTERFACE custom \
  CONFIG.TTC1_BOARD_INTERFACE custom \
  CONFIG.TTC2_BOARD_INTERFACE custom \
  CONFIG.TTC3_BOARD_INTERFACE custom \
  CONFIG.UART0_BOARD_INTERFACE custom \
  CONFIG.UART1_BOARD_INTERFACE custom \
  CONFIG.USB0_BOARD_INTERFACE custom \
  CONFIG.USB1_BOARD_INTERFACE custom \
  CONFIG.preset None \
] [get_bd_cells ZynqMPSoC]
# 736 more settings of ZynqMPSoC are not shown: defaults, MIO pin electricals, DDR timing, and values the tool derives
create_bd_cell -type ip -vlnv xilinx.com:ip:proc_sys_reset:5.0 sys_resetter_primary
set_property -dict {CONFIG.C_AUX_RESET_HIGH 0 CONFIG.C_AUX_RST_WIDTH 1} [get_bd_cells sys_resetter_primary]
create_bd_cell -type ip -vlnv xilinx.com:ip:util_vector_logic:2.0 sys_resetter_primary_BUS_RST_N
set_property -dict {CONFIG.C_OPERATION not CONFIG.C_SIZE 1} [get_bd_cells sys_resetter_primary_BUS_RST_N]
create_bd_cell -type ip -vlnv xilinx.com:ip:proc_sys_reset:5.0 sys_resetter_c2c
set_property -dict {CONFIG.C_AUX_RESET_HIGH 1 CONFIG.C_AUX_RST_WIDTH 1} [get_bd_cells sys_resetter_c2c]
create_bd_cell -type ip -vlnv xilinx.com:ip:util_vector_logic:2.0 sys_resetter_c2c_BUS_RST_N
set_property -dict {CONFIG.C_OPERATION not CONFIG.C_SIZE 1} [get_bd_cells sys_resetter_c2c_BUS_RST_N]
create_bd_cell -type ip -vlnv xilinx.com:ip:proc_sys_reset:5.0 SYS_RESET
set_property -dict {CONFIG.C_AUX_RESET_HIGH 0 CONFIG.C_AUX_RST_WIDTH 1} [get_bd_cells SYS_RESET]
create_bd_cell -type ip -vlnv xilinx.com:ip:util_vector_logic:2.0 SYS_RESET_BUS_RST_N
set_property -dict {CONFIG.C_OPERATION not CONFIG.C_SIZE 1} [get_bd_cells SYS_RESET_BUS_RST_N]
create_bd_cell -type ip -vlnv xilinx.com:ip:axi_interconnect:2.1 AXI_MAIN_INTERCONNECT
set_property -dict {CONFIG.NUM_MI 15 CONFIG.NUM_SI 2 CONFIG.STRATEGY 1} [get_bd_cells AXI_MAIN_INTERCONNECT]
create_bd_cell -type ip -vlnv xilinx.com:ip:axi_interconnect:2.1 AXI_C2C_INTERCONNECT
set_property -dict {CONFIG.NUM_MI 8 CONFIG.NUM_SI 1 CONFIG.STRATEGY 1} [get_bd_cells AXI_C2C_INTERCONNECT]
create_bd_cell -type ip -vlnv xilinx.com:ip:axi_intc:4.1 IRQ0_INTR_CTRL
set_property -dict {CONFIG.C_IRQ_CONNECTION 1} [get_bd_cells IRQ0_INTR_CTRL]
create_bd_cell -type ip -vlnv xilinx.com:ip:xlconcat:2.1 IRQ0_INTR_CTRL_IRQ
set_property -dict {CONFIG.NUM_PORTS 12} [get_bd_cells IRQ0_INTR_CTRL_IRQ]
create_bd_cell -type ip -vlnv xilinx.com:ip:axi_chip2chip:5.0 C2C1
set_property -dict [list \
  CONFIG.C_AXI_DATA_WIDTH 32 \
  CONFIG.C_AXI_STB_WIDTH 4 \
  CONFIG.C_EN_AXI_LINK_HNDLR false \
  CONFIG.C_INCLUDE_AXILITE 1 \
  CONFIG.C_INTERFACE_MODE 0 \
  CONFIG.C_INTERFACE_TYPE 2 \
  CONFIG.C_MASTER_FPGA 1 \
] [get_bd_cells C2C1]
create_bd_cell -type ip -vlnv xilinx.com:ip:aurora_64b66b:12.0 C2C1_PHY
set_property -dict [list \
  CONFIG.C_AURORA_LANES 1 \
  CONFIG.C_LINE_RATE 5 \
  CONFIG.C_REFCLK_FREQUENCY 100 \
  CONFIG.C_USE_CHIPSCOPE true \
  CONFIG.SINGLEEND_GTREFCLK true \
  CONFIG.SupportLevel 1 \
  CONFIG.TransceiverControl true \
  CONFIG.drp_mode Native \
  CONFIG.interface_mode Streaming \
] [get_bd_cells C2C1_PHY]
create_bd_cell -type ip -vlnv xilinx.com:ip:axi_firewall:1.2 C2C1_AXI_FW
create_bd_cell -type ip -vlnv xilinx.com:ip:axi_chip2chip:5.0 C2C1B
set_property -dict [list \
  CONFIG.C_AXI_DATA_WIDTH 32 \
  CONFIG.C_AXI_STB_WIDTH 4 \
  CONFIG.C_EN_AXI_LINK_HNDLR false \
  CONFIG.C_INCLUDE_AXILITE 1 \
  CONFIG.C_INTERFACE_MODE 0 \
  CONFIG.C_INTERFACE_TYPE 2 \
  CONFIG.C_MASTER_FPGA 1 \
] [get_bd_cells C2C1B]
create_bd_cell -type ip -vlnv xilinx.com:ip:aurora_64b66b:12.0 C2C1B_PHY
set_property -dict [list \
  CONFIG.C_AURORA_LANES 1 \
  CONFIG.C_LINE_RATE 5 \
  CONFIG.C_REFCLK_FREQUENCY 100 \
  CONFIG.C_USE_CHIPSCOPE true \
  CONFIG.SINGLEEND_GTREFCLK true \
  CONFIG.SupportLevel 1 \
  CONFIG.TransceiverControl true \
  CONFIG.drp_mode Native \
  CONFIG.interface_mode Streaming \
] [get_bd_cells C2C1B_PHY]
create_bd_cell -type ip -vlnv xilinx.com:ip:axi_firewall:1.2 C2C1_AXILITE_FW
create_bd_cell -type ip -vlnv xilinx.com:ip:axi_chip2chip:5.0 C2C2
set_property -dict [list \
  CONFIG.C_AXI_DATA_WIDTH 32 \
  CONFIG.C_AXI_STB_WIDTH 4 \
  CONFIG.C_EN_AXI_LINK_HNDLR false \
  CONFIG.C_INCLUDE_AXILITE 1 \
  CONFIG.C_INTERFACE_MODE 0 \
  CONFIG.C_INTERFACE_TYPE 2 \
  CONFIG.C_MASTER_FPGA 1 \
] [get_bd_cells C2C2]
create_bd_cell -type ip -vlnv xilinx.com:ip:aurora_64b66b:12.0 C2C2_PHY
set_property -dict [list \
  CONFIG.C_AURORA_LANES 1 \
  CONFIG.C_LINE_RATE 5 \
  CONFIG.C_REFCLK_FREQUENCY 100 \
  CONFIG.C_USE_CHIPSCOPE true \
  CONFIG.SINGLEEND_GTREFCLK true \
  CONFIG.SupportLevel 1 \
  CONFIG.TransceiverControl true \
  CONFIG.drp_mode Native \
  CONFIG.interface_mode Streaming \
] [get_bd_cells C2C2_PHY]
create_bd_cell -type ip -vlnv xilinx.com:ip:axi_firewall:1.2 C2C2_AXI_FW
create_bd_cell -type ip -vlnv xilinx.com:ip:axi_chip2chip:5.0 C2C2B
set_property -dict [list \
  CONFIG.C_AXI_DATA_WIDTH 32 \
  CONFIG.C_AXI_STB_WIDTH 4 \
  CONFIG.C_EN_AXI_LINK_HNDLR false \
  CONFIG.C_INCLUDE_AXILITE 1 \
  CONFIG.C_INTERFACE_MODE 0 \
  CONFIG.C_INTERFACE_TYPE 2 \
  CONFIG.C_MASTER_FPGA 1 \
] [get_bd_cells C2C2B]
create_bd_cell -type ip -vlnv xilinx.com:ip:aurora_64b66b:12.0 C2C2B_PHY
set_property -dict [list \
  CONFIG.C_AURORA_LANES 1 \
  CONFIG.C_LINE_RATE 5 \
  CONFIG.C_REFCLK_FREQUENCY 100 \
  CONFIG.C_USE_CHIPSCOPE true \
  CONFIG.SINGLEEND_GTREFCLK true \
  CONFIG.SupportLevel 1 \
  CONFIG.TransceiverControl true \
  CONFIG.drp_mode Native \
  CONFIG.interface_mode Streaming \
] [get_bd_cells C2C2B_PHY]
create_bd_cell -type ip -vlnv xilinx.com:ip:axi_firewall:1.2 C2C2_AXILITE_FW
create_bd_cell -type ip -vlnv xilinx.com:ip:axi_interconnect:2.1 AXI_LOCAL_INTERCONNECT
set_property -dict {CONFIG.NUM_MI 5 CONFIG.NUM_SI 1 CONFIG.STRATEGY 1} [get_bd_cells AXI_LOCAL_INTERCONNECT]
create_bd_cell -type ip -vlnv xilinx.com:ip:axi_bram_ctrl:4.1 PL_MEM
set_property -dict {CONFIG.SINGLE_PORT_BRAM 1} [get_bd_cells PL_MEM]
create_bd_cell -type ip -vlnv xilinx.com:ip:blk_mem_gen:8.4 PL_MEM_RAM
set_property -dict {CONFIG.Assume_Synchronous_Clk false CONFIG.Memory_Type True_Dual_Port_RAM} [get_bd_cells PL_MEM_RAM]
create_bd_cell -type ip -vlnv xilinx.com:ip:axi_bram_ctrl:4.1 PL_MEM_CM
set_property -dict {CONFIG.SINGLE_PORT_BRAM 1} [get_bd_cells PL_MEM_CM]
create_bd_cell -type ip -vlnv xilinx.com:ip:blk_mem_gen:8.4 PL_MEM_CM_RAM
set_property -dict {CONFIG.Assume_Synchronous_Clk false CONFIG.Memory_Type True_Dual_Port_RAM} [get_bd_cells PL_MEM_CM_RAM]
create_bd_cell -type ip -vlnv xilinx.com:ip:axi_firewall:1.2 CM_MON_AXI_FW
create_bd_cell -type ip -vlnv xilinx.com:ip:system_management_wiz:1.3 MONITOR
set_property -dict {CONFIG.DCLK_FREQUENCY 49.9995 CONFIG.USER_TEMP_ALARM false} [get_bd_cells MONITOR]
create_bd_cell -type ip -vlnv xilinx.com:ip:axi_iic:2.1 SI
create_bd_cell -type ip -vlnv xilinx.com:ip:axi_uartlite:2.0 CM1_UART
set_property -dict {CONFIG.C_BAUDRATE 115200} [get_bd_cells CM1_UART]
create_bd_cell -type ip -vlnv xilinx.com:ip:axi_uartlite:2.0 CM2_UART
set_property -dict {CONFIG.C_BAUDRATE 115200} [get_bd_cells CM2_UART]
create_bd_cell -type ip -vlnv xilinx.com:ip:axi_uartlite:2.0 CM1_PB_UART
set_property -dict {CONFIG.C_BAUDRATE 115200} [get_bd_cells CM1_PB_UART]
create_bd_cell -type ip -vlnv xilinx.com:ip:axi_uartlite:2.0 CM2_PB_UART
set_property -dict {CONFIG.C_BAUDRATE 115200} [get_bd_cells CM2_PB_UART]
create_bd_cell -type ip -vlnv xilinx.com:ip:axi_uartlite:2.0 ESM_UART
set_property -dict {CONFIG.C_BAUDRATE 115200} [get_bd_cells ESM_UART]
create_bd_cell -type ip -vlnv xilinx.com:ip:axi_perf_mon:5.0 AXI_MON
set_property -dict [list \
  CONFIG.C_ENABLE_ADVANCED 1 \
  CONFIG.C_ENABLE_EVENT_COUNT 1 \
  CONFIG.C_ENABLE_PROFILE 0 \
  CONFIG.C_NUM_MONITOR_SLOTS 2 \
  CONFIG.C_NUM_OF_COUNTERS 10 \
  CONFIG.C_SLOT_0_AXI_PROTOCOL AXI4 \
  CONFIG.C_SLOT_1_AXI_PROTOCOL AXI4 \
  CONFIG.ENABLE_EXT_TRIGGERS 0 \
] [get_bd_cells AXI_MON]
create_bd_cell -type ip -vlnv xilinx.com:ip:axi_firewall:1.2 INT_AXI_FW
create_bd_cell -type hier DMA_JTAG

# ---- hierarchy /DMA_JTAG ----
current_bd_instance /DMA_JTAG
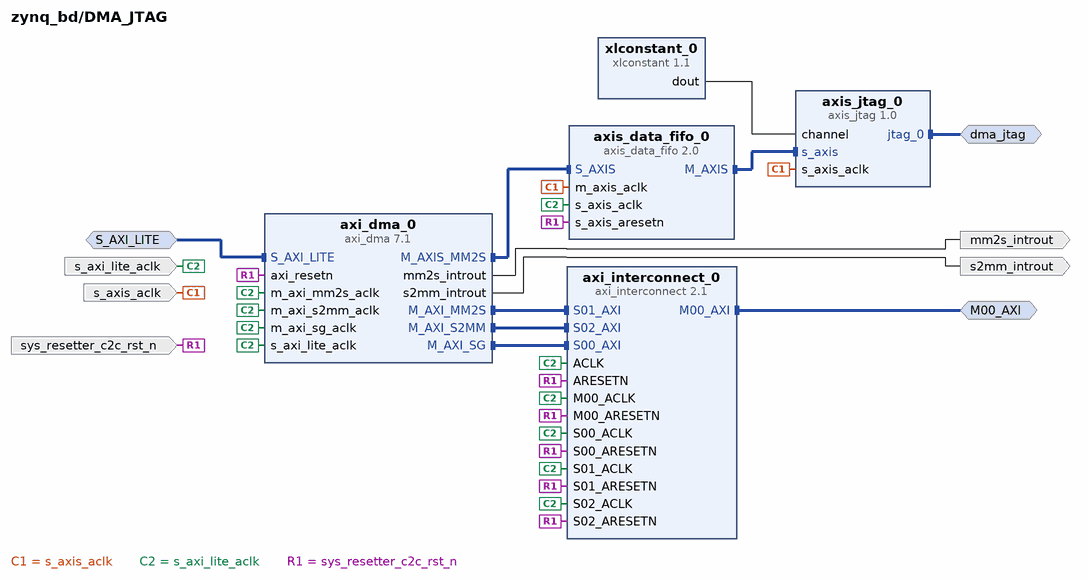
[diagram p5: block diagram inside /DMA_JTAG]
create_bd_intf_pin -mode Slave -vlnv xilinx.com:interface:aximm_rtl:1.0 S_AXI_LITE
create_bd_intf_pin -mode Master -vlnv xilinx.com:interface:jtag_rtl:2.0 dma_jtag
create_bd_intf_pin -mode Master -vlnv xilinx.com:interface:aximm_rtl:1.0 M00_AXI
create_bd_pin -dir I -type rst sys_resetter_c2c_rst_n
create_bd_pin -dir I -type clk s_axi_lite_aclk
create_bd_pin -dir O -type intr mm2s_introut
create_bd_pin -dir O -type intr s2mm_introut
create_bd_pin -dir I -type clk s_axis_aclk

create_bd_cell -type ip -vlnv xilinx.com:ip:axis_data_fifo:2.0 axis_data_fifo_0
set_property -dict {CONFIG.FIFO_DEPTH 64 CONFIG.IS_ACLK_ASYNC 1 CONFIG.TDATA_NUM_BYTES 8} [get_bd_cells axis_data_fifo_0]
create_bd_cell -type ip -vlnv xilinx.com:ip:axi_dma:7.1 axi_dma_0
set_property -dict [list \
  CONFIG.c_addr_width 64 \
  CONFIG.c_m_axi_mm2s_data_width 64 \
  CONFIG.c_m_axi_s2mm_data_width 64 \
  CONFIG.c_m_axis_mm2s_tdata_width 64 \
  CONFIG.c_mm2s_burst_size 128 \
  CONFIG.c_s2mm_burst_size 128 \
  CONFIG.c_s_axis_s2mm_tdata_width 64 \
  CONFIG.c_sg_include_stscntrl_strm 0 \
  CONFIG.c_sg_length_width 26 \
] [get_bd_cells axi_dma_0]
create_bd_cell -type ip -vlnv xilinx.com:ip:xlconstant:1.1 xlconstant_0
set_property -dict {CONFIG.CONST_VAL 0} [get_bd_cells xlconstant_0]
create_bd_cell -type ip -vlnv user.org:user:axis_jtag:1.0 axis_jtag_0
create_bd_cell -type ip -vlnv xilinx.com:ip:axi_interconnect:2.1 axi_interconnect_0
set_property -dict {CONFIG.NUM_MI 1 CONFIG.NUM_SI 3} [get_bd_cells axi_interconnect_0]

# ---- connections ----

current_bd_instance /DMA_JTAG
connect_bd_intf_net -intf_net AXI_C2C_INTERCONNECT_M07_AXI [get_bd_intf_pins S_AXI_LITE] [get_bd_intf_pins axi_dma_0/S_AXI_LITE]
connect_bd_intf_net [get_bd_intf_pins axi_dma_0/M_AXIS_MM2S] [get_bd_intf_pins axis_data_fifo_0/S_AXIS]
connect_bd_intf_net [get_bd_intf_pins axi_dma_0/M_AXI_MM2S] [get_bd_intf_pins axi_interconnect_0/S01_AXI]
connect_bd_intf_net [get_bd_intf_pins axi_dma_0/M_AXI_S2MM] [get_bd_intf_pins axi_interconnect_0/S02_AXI]
connect_bd_intf_net [get_bd_intf_pins axi_dma_0/M_AXI_SG] [get_bd_intf_pins axi_interconnect_0/S00_AXI]
connect_bd_intf_net [get_bd_intf_pins M00_AXI] [get_bd_intf_pins axi_interconnect_0/M00_AXI]
connect_bd_intf_net [get_bd_intf_pins axis_data_fifo_0/M_AXIS] [get_bd_intf_pins axis_jtag_0/s_axis]
connect_bd_intf_net [get_bd_intf_pins dma_jtag] [get_bd_intf_pins axis_jtag_0/jtag_0]
connect_bd_net [get_bd_pins s_axis_aclk] [get_bd_pins axis_jtag_0/s_axis_aclk] [get_bd_pins axis_data_fifo_0/m_axis_aclk]
connect_bd_net -net ZynqMPSoC_pl_clk0 [get_bd_pins s_axi_lite_aclk] \
  [get_bd_pins axi_dma_0/s_axi_lite_aclk] [get_bd_pins axi_dma_0/m_axi_sg_aclk] [get_bd_pins axi_dma_0/m_axi_mm2s_aclk] \
  [get_bd_pins axi_dma_0/m_axi_s2mm_aclk] [get_bd_pins axi_interconnect_0/ACLK] [get_bd_pins axi_interconnect_0/S00_ACLK] \
  [get_bd_pins axi_interconnect_0/M00_ACLK] [get_bd_pins axi_interconnect_0/S01_ACLK] \
  [get_bd_pins axi_interconnect_0/S02_ACLK] [get_bd_pins axis_data_fifo_0/s_axis_aclk]
connect_bd_net [get_bd_pins axi_dma_0/mm2s_introut] [get_bd_pins mm2s_introut]
connect_bd_net [get_bd_pins axi_dma_0/s2mm_introut] [get_bd_pins s2mm_introut]
connect_bd_net -net sys_resetter_c2c_peripheral_aresetn [get_bd_pins sys_resetter_c2c_rst_n] \
  [get_bd_pins axi_dma_0/axi_resetn] [get_bd_pins axi_interconnect_0/ARESETN] [get_bd_pins axi_interconnect_0/S00_ARESETN] \
  [get_bd_pins axi_interconnect_0/M00_ARESETN] [get_bd_pins axi_interconnect_0/S01_ARESETN] \
  [get_bd_pins axi_interconnect_0/S02_ARESETN] [get_bd_pins axis_data_fifo_0/s_axis_aresetn]
connect_bd_net [get_bd_pins xlconstant_0/dout] [get_bd_pins axis_jtag_0/channel]

current_bd_instance /
connect_bd_intf_net [get_bd_intf_pins CM_MON_AXI_FW/S_AXI] [get_bd_intf_ports AXIM_PL]
connect_bd_intf_net [get_bd_intf_pins C2C1_AXI_FW/S_AXI] [get_bd_intf_pins AXI_C2C_INTERCONNECT/M00_AXI]
connect_bd_intf_net [get_bd_intf_pins C2C1_AXILITE_FW/S_AXI] [get_bd_intf_pins AXI_C2C_INTERCONNECT/M01_AXI]
connect_bd_intf_net [get_bd_intf_pins C2C2_AXI_FW/S_AXI] [get_bd_intf_pins AXI_C2C_INTERCONNECT/M02_AXI]
connect_bd_intf_net [get_bd_intf_pins C2C2_AXILITE_FW/S_AXI] [get_bd_intf_pins AXI_C2C_INTERCONNECT/M03_AXI]
connect_bd_intf_net [get_bd_intf_pins CM_MON_AXI_FW/S_AXI_CTL] [get_bd_intf_pins AXI_C2C_INTERCONNECT/M04_AXI]
connect_bd_intf_net [get_bd_intf_pins AXI_MON/S_AXI] [get_bd_intf_pins AXI_C2C_INTERCONNECT/M05_AXI]
connect_bd_intf_net [get_bd_intf_pins INT_AXI_FW/S_AXI_CTL] [get_bd_intf_pins AXI_C2C_INTERCONNECT/M06_AXI]
connect_bd_intf_net [get_bd_intf_pins AXI_C2C_INTERCONNECT/M07_AXI] [get_bd_intf_pins DMA_JTAG/S_AXI_LITE]
connect_bd_intf_net [get_bd_intf_pins PL_MEM/S_AXI] [get_bd_intf_pins AXI_LOCAL_INTERCONNECT/M00_AXI]
connect_bd_intf_net [get_bd_intf_pins PL_MEM_CM/S_AXI] [get_bd_intf_pins AXI_LOCAL_INTERCONNECT/M01_AXI]
connect_bd_intf_net [get_bd_intf_ports SERV] [get_bd_intf_pins AXI_LOCAL_INTERCONNECT/M02_AXI]
connect_bd_intf_net [get_bd_intf_ports SLAVE_I2C] [get_bd_intf_pins AXI_LOCAL_INTERCONNECT/M03_AXI]
connect_bd_intf_net [get_bd_intf_ports SM_INFO] [get_bd_intf_pins AXI_LOCAL_INTERCONNECT/M04_AXI]
connect_bd_intf_net [get_bd_intf_pins IRQ0_INTR_CTRL/s_axi] [get_bd_intf_pins AXI_MAIN_INTERCONNECT/M00_AXI]
connect_bd_intf_net [get_bd_intf_pins C2C1_AXI_FW/S_AXI_CTL] [get_bd_intf_pins AXI_MAIN_INTERCONNECT/M01_AXI]
connect_bd_intf_net [get_bd_intf_pins C2C1_AXILITE_FW/S_AXI_CTL] [get_bd_intf_pins AXI_MAIN_INTERCONNECT/M02_AXI]
connect_bd_intf_net [get_bd_intf_pins C2C2_AXI_FW/S_AXI_CTL] [get_bd_intf_pins AXI_MAIN_INTERCONNECT/M03_AXI]
connect_bd_intf_net [get_bd_intf_pins C2C2_AXILITE_FW/S_AXI_CTL] [get_bd_intf_pins AXI_MAIN_INTERCONNECT/M04_AXI]
connect_bd_intf_net [get_bd_intf_pins AXI_MAIN_INTERCONNECT/M05_AXI] [get_bd_intf_pins AXI_LOCAL_INTERCONNECT/S00_AXI]
connect_bd_intf_net [get_bd_intf_pins MONITOR/S_AXI_LITE] [get_bd_intf_pins AXI_MAIN_INTERCONNECT/M06_AXI]
connect_bd_intf_net [get_bd_intf_pins SI/S_AXI] [get_bd_intf_pins AXI_MAIN_INTERCONNECT/M07_AXI]
connect_bd_intf_net [get_bd_intf_ports PLXVC] [get_bd_intf_pins AXI_MAIN_INTERCONNECT/M08_AXI]
connect_bd_intf_net [get_bd_intf_ports CM] [get_bd_intf_pins AXI_MAIN_INTERCONNECT/M09_AXI]
connect_bd_intf_net [get_bd_intf_pins CM1_UART/S_AXI] [get_bd_intf_pins AXI_MAIN_INTERCONNECT/M10_AXI]
connect_bd_intf_net [get_bd_intf_pins CM2_UART/S_AXI] [get_bd_intf_pins AXI_MAIN_INTERCONNECT/M11_AXI]
connect_bd_intf_net [get_bd_intf_pins CM1_PB_UART/S_AXI] [get_bd_intf_pins AXI_MAIN_INTERCONNECT/M12_AXI]
connect_bd_intf_net [get_bd_intf_pins CM2_PB_UART/S_AXI] [get_bd_intf_pins AXI_MAIN_INTERCONNECT/M13_AXI]
connect_bd_intf_net [get_bd_intf_pins ESM_UART/S_AXI] [get_bd_intf_pins AXI_MAIN_INTERCONNECT/M14_AXI]
connect_bd_intf_net [get_bd_intf_pins C2C1B/AXIS_TX] [get_bd_intf_pins C2C1B_PHY/USER_DATA_S_AXIS_TX]
connect_bd_intf_net [get_bd_intf_ports C2C1B_PHY_DRP] [get_bd_intf_pins C2C1B_PHY/GT0_DRP]
connect_bd_intf_net [get_bd_intf_ports C2C1B_PHY_Tx] [get_bd_intf_pins C2C1B_PHY/GT_SERIAL_TX]
connect_bd_intf_net [get_bd_intf_ports C2C1B_PHY_Rx] [get_bd_intf_pins C2C1B_PHY/GT_SERIAL_RX]
connect_bd_intf_net [get_bd_intf_ports C2C1B_PHY_DEBUG] [get_bd_intf_pins C2C1B_PHY/TRANSCEIVER_DEBUG]
connect_bd_intf_net [get_bd_intf_pins C2C1B_PHY/USER_DATA_M_AXIS_RX] [get_bd_intf_pins C2C1B/AXIS_RX]
connect_bd_intf_net [get_bd_intf_pins C2C1B/s_axi_lite] [get_bd_intf_pins C2C1_AXILITE_FW/M_AXI]
connect_bd_intf_net [get_bd_intf_pins C2C1/AXIS_TX] [get_bd_intf_pins C2C1_PHY/USER_DATA_S_AXIS_TX]
connect_bd_intf_net [get_bd_intf_pins C2C1/s_axi] [get_bd_intf_pins C2C1_AXI_FW/M_AXI]
connect_bd_intf_net [get_bd_intf_ports C2C1_PHY_DRP] [get_bd_intf_pins C2C1_PHY/GT0_DRP]
connect_bd_intf_net [get_bd_intf_ports C2C1_PHY_Tx] [get_bd_intf_pins C2C1_PHY/GT_SERIAL_TX]
connect_bd_intf_net [get_bd_intf_ports C2C1_PHY_Rx] [get_bd_intf_pins C2C1_PHY/GT_SERIAL_RX]
connect_bd_intf_net [get_bd_intf_ports C2C1_PHY_DEBUG] [get_bd_intf_pins C2C1_PHY/TRANSCEIVER_DEBUG]
connect_bd_intf_net [get_bd_intf_pins C2C1_PHY/USER_DATA_M_AXIS_RX] [get_bd_intf_pins C2C1/AXIS_RX]
connect_bd_intf_net [get_bd_intf_pins C2C2B/AXIS_TX] [get_bd_intf_pins C2C2B_PHY/USER_DATA_S_AXIS_TX]
connect_bd_intf_net [get_bd_intf_ports C2C2B_PHY_DRP] [get_bd_intf_pins C2C2B_PHY/GT0_DRP]
connect_bd_intf_net [get_bd_intf_ports C2C2B_PHY_Tx] [get_bd_intf_pins C2C2B_PHY/GT_SERIAL_TX]
connect_bd_intf_net [get_bd_intf_ports C2C2B_PHY_Rx] [get_bd_intf_pins C2C2B_PHY/GT_SERIAL_RX]
connect_bd_intf_net [get_bd_intf_ports C2C2B_PHY_DEBUG] [get_bd_intf_pins C2C2B_PHY/TRANSCEIVER_DEBUG]
connect_bd_intf_net [get_bd_intf_pins C2C2B_PHY/USER_DATA_M_AXIS_RX] [get_bd_intf_pins C2C2B/AXIS_RX]
connect_bd_intf_net [get_bd_intf_pins C2C2B/s_axi_lite] [get_bd_intf_pins C2C2_AXILITE_FW/M_AXI]
connect_bd_intf_net [get_bd_intf_pins C2C2/AXIS_TX] [get_bd_intf_pins C2C2_PHY/USER_DATA_S_AXIS_TX]
connect_bd_intf_net [get_bd_intf_pins C2C2/s_axi] [get_bd_intf_pins C2C2_AXI_FW/M_AXI]
connect_bd_intf_net [get_bd_intf_ports C2C2_PHY_DRP] [get_bd_intf_pins C2C2_PHY/GT0_DRP]
connect_bd_intf_net [get_bd_intf_ports C2C2_PHY_Tx] [get_bd_intf_pins C2C2_PHY/GT_SERIAL_TX]
connect_bd_intf_net [get_bd_intf_ports C2C2_PHY_Rx] [get_bd_intf_pins C2C2_PHY/GT_SERIAL_RX]
connect_bd_intf_net [get_bd_intf_ports C2C2_PHY_DEBUG] [get_bd_intf_pins C2C2_PHY/TRANSCEIVER_DEBUG]
connect_bd_intf_net [get_bd_intf_pins C2C2_PHY/USER_DATA_M_AXIS_RX] [get_bd_intf_pins C2C2/AXIS_RX]
connect_bd_intf_net [get_bd_intf_ports CM1_PB_UART] [get_bd_intf_pins CM1_PB_UART/UART]
connect_bd_intf_net [get_bd_intf_ports CM1_UART] [get_bd_intf_pins CM1_UART/UART]
connect_bd_intf_net [get_bd_intf_ports CM2_PB_UART] [get_bd_intf_pins CM2_PB_UART/UART]
connect_bd_intf_net [get_bd_intf_ports CM2_UART] [get_bd_intf_pins CM2_UART/UART]
connect_bd_intf_net [get_bd_intf_ports ESM_UART] [get_bd_intf_pins ESM_UART/UART]
connect_bd_intf_net [get_bd_intf_pins PL_MEM/BRAM_PORTA] [get_bd_intf_pins PL_MEM_RAM/BRAM_PORTA]
connect_bd_intf_net [get_bd_intf_pins PL_MEM_CM/BRAM_PORTA] [get_bd_intf_pins PL_MEM_CM_RAM/BRAM_PORTA]
connect_bd_intf_net [get_bd_intf_ports PL_MEM_CM_RAM_PORTB] [get_bd_intf_pins PL_MEM_CM_RAM/BRAM_PORTB]
connect_bd_intf_net [get_bd_intf_ports PL_MEM_RAM_PORTB] [get_bd_intf_pins PL_MEM_RAM/BRAM_PORTB]
connect_bd_intf_net [get_bd_intf_pins AXI_MAIN_INTERCONNECT/S00_AXI] [get_bd_intf_pins INT_AXI_FW/M_AXI]
connect_bd_intf_net [get_bd_intf_pins AXI_MAIN_INTERCONNECT/S01_AXI] [get_bd_intf_pins CM_MON_AXI_FW/M_AXI]
connect_bd_intf_net [get_bd_intf_pins INT_AXI_FW/S_AXI] [get_bd_intf_pins ZynqMPSoC/M_AXI_HPM0_FPD]
connect_bd_intf_net [get_bd_intf_pins ZynqMPSoC/M_AXI_HPM1_FPD] [get_bd_intf_pins AXI_C2C_INTERCONNECT/S00_AXI]
connect_bd_intf_net [get_bd_intf_pins ZynqMPSoC/M_AXI_HPM1_FPD] [get_bd_intf_pins AXI_MON/SLOT_1_AXI]
connect_bd_intf_net -intf_net axi_interconnect_0_M00_AXI [get_bd_intf_pins DMA_JTAG/M00_AXI] [get_bd_intf_pins ZynqMPSoC/S_AXI_HP1_FPD]
connect_bd_intf_net -intf_net axis_jtag_0_jtag_0 [get_bd_intf_ports dma_jtag] [get_bd_intf_pins DMA_JTAG/dma_jtag]
connect_bd_net [get_bd_pins C2C1B_PHY/channel_up] [get_bd_ports C2C1B_PHY_channel_up] [get_bd_pins C2C1B/axi_c2c_aurora_channel_up]
connect_bd_net [get_bd_pins C2C1B_PHY/gt_pll_lock] [get_bd_ports C2C1B_PHY_gt_pll_lock]
connect_bd_net [get_bd_pins C2C1B_PHY/hard_err] [get_bd_ports C2C1B_PHY_hard_err]
connect_bd_net [get_bd_pins C2C1B_PHY/lane_up] [get_bd_ports C2C1B_PHY_lane_up]
connect_bd_net [get_bd_pins C2C1B_PHY/link_reset_out] [get_bd_ports C2C1B_PHY_link_reset_out]
connect_bd_net [get_bd_pins C2C1B_PHY/mmcm_not_locked_out] [get_bd_ports C2C1B_PHY_mmcm_not_locked_out] [get_bd_pins C2C1B/aurora_mmcm_not_locked]
connect_bd_net [get_bd_ports C2C1B_PHY_power_down] [get_bd_pins C2C1B_PHY/power_down]
connect_bd_net [get_bd_ports C2C1B_PHY_refclk] [get_bd_pins C2C1B_PHY/refclk1_in]
connect_bd_net [get_bd_pins C2C1B_PHY/soft_err] [get_bd_ports C2C1B_PHY_soft_err]
connect_bd_net [get_bd_pins C2C1B_PHY/user_clk_out] [get_bd_pins C2C1B/axi_c2c_phy_clk] [get_bd_ports C2C1B_PHY_CLK]
connect_bd_net [get_bd_pins C2C1B/aurora_do_cc] [get_bd_ports C2C1B_aurora_do_cc]
connect_bd_net [get_bd_ports C2C1B_aurora_pma_init_in] [get_bd_pins C2C1B/aurora_pma_init_in]
connect_bd_net [get_bd_pins C2C1B/aurora_pma_init_out] [get_bd_pins C2C1B_PHY/pma_init]
connect_bd_net [get_bd_pins C2C1B/aurora_reset_pb] [get_bd_ports C2C1B_aurora_reset_pb] [get_bd_pins C2C1B_PHY/reset_pb]
connect_bd_net [get_bd_pins C2C1B/axi_c2c_config_error_out] [get_bd_ports C2C1B_axi_c2c_config_error_out]
connect_bd_net [get_bd_pins C2C1B/axi_c2c_link_error_out] [get_bd_ports C2C1B_axi_c2c_link_error_out]
connect_bd_net [get_bd_pins C2C1B/axi_c2c_link_status_out] [get_bd_ports C2C1B_axi_c2c_link_status_out]
connect_bd_net [get_bd_pins C2C1B/axi_c2c_multi_bit_error_out] [get_bd_ports C2C1B_axi_c2c_multi_bit_error_out]
connect_bd_net [get_bd_pins C2C1B/axi_c2c_s2m_intr_out] [get_bd_pins IRQ0_INTR_CTRL_IRQ/In1]
connect_bd_net [get_bd_pins C2C1_PHY/channel_up] [get_bd_ports C2C1_PHY_channel_up] [get_bd_pins C2C1/axi_c2c_aurora_channel_up]
connect_bd_net [get_bd_pins C2C1_PHY/gt_pll_lock] [get_bd_ports C2C1_PHY_gt_pll_lock]
connect_bd_net [get_bd_pins C2C1_PHY/hard_err] [get_bd_ports C2C1_PHY_hard_err]
connect_bd_net [get_bd_pins C2C1_PHY/lane_up] [get_bd_ports C2C1_PHY_lane_up]
connect_bd_net [get_bd_pins C2C1_PHY/link_reset_out] [get_bd_ports C2C1_PHY_link_reset_out]
connect_bd_net [get_bd_pins C2C1_PHY/mmcm_not_locked_out] [get_bd_ports C2C1_PHY_mmcm_not_locked_out] [get_bd_pins C2C1/aurora_mmcm_not_locked]
connect_bd_net [get_bd_ports C2C1_PHY_power_down] [get_bd_pins C2C1_PHY/power_down]
connect_bd_net [get_bd_ports C2C1_PHY_refclk] [get_bd_pins C2C1_PHY/refclk1_in]
connect_bd_net [get_bd_pins C2C1_PHY/soft_err] [get_bd_ports C2C1_PHY_soft_err]
connect_bd_net [get_bd_pins C2C1_PHY/user_clk_out] [get_bd_pins C2C1/axi_c2c_phy_clk] [get_bd_ports C2C1_PHY_CLK]
connect_bd_net [get_bd_pins C2C1/aurora_do_cc] [get_bd_ports C2C1_aurora_do_cc]
connect_bd_net [get_bd_ports C2C1_aurora_pma_init_in] [get_bd_pins C2C1/aurora_pma_init_in]
connect_bd_net [get_bd_pins C2C1/aurora_pma_init_out] [get_bd_pins C2C1_PHY/pma_init]
connect_bd_net [get_bd_pins C2C1/aurora_reset_pb] [get_bd_ports C2C1_aurora_reset_pb] [get_bd_pins C2C1_PHY/reset_pb]
connect_bd_net [get_bd_pins C2C1/axi_c2c_config_error_out] [get_bd_ports C2C1_axi_c2c_config_error_out]
connect_bd_net [get_bd_pins C2C1/axi_c2c_link_error_out] [get_bd_ports C2C1_axi_c2c_link_error_out]
connect_bd_net [get_bd_pins C2C1/axi_c2c_link_status_out] [get_bd_ports C2C1_axi_c2c_link_status_out]
connect_bd_net [get_bd_pins C2C1/axi_c2c_multi_bit_error_out] [get_bd_ports C2C1_axi_c2c_multi_bit_error_out]
connect_bd_net [get_bd_pins C2C1/axi_c2c_s2m_intr_out] [get_bd_pins IRQ0_INTR_CTRL_IRQ/In0]
connect_bd_net [get_bd_pins C2C2B_PHY/channel_up] [get_bd_ports C2C2B_PHY_channel_up] [get_bd_pins C2C2B/axi_c2c_aurora_channel_up]
connect_bd_net [get_bd_pins C2C2B_PHY/gt_pll_lock] [get_bd_ports C2C2B_PHY_gt_pll_lock]
connect_bd_net [get_bd_pins C2C2B_PHY/hard_err] [get_bd_ports C2C2B_PHY_hard_err]
connect_bd_net [get_bd_pins C2C2B_PHY/lane_up] [get_bd_ports C2C2B_PHY_lane_up]
connect_bd_net [get_bd_pins C2C2B_PHY/link_reset_out] [get_bd_ports C2C2B_PHY_link_reset_out]
connect_bd_net [get_bd_pins C2C2B_PHY/mmcm_not_locked_out] [get_bd_ports C2C2B_PHY_mmcm_not_locked_out] [get_bd_pins C2C2B/aurora_mmcm_not_locked]
connect_bd_net [get_bd_ports C2C2B_PHY_power_down] [get_bd_pins C2C2B_PHY/power_down]
connect_bd_net [get_bd_ports C2C2B_PHY_refclk] [get_bd_pins C2C2B_PHY/refclk1_in]
connect_bd_net [get_bd_pins C2C2B_PHY/soft_err] [get_bd_ports C2C2B_PHY_soft_err]
connect_bd_net [get_bd_pins C2C2B_PHY/user_clk_out] [get_bd_pins C2C2B/axi_c2c_phy_clk] [get_bd_ports C2C2B_PHY_CLK]
connect_bd_net [get_bd_pins C2C2B/aurora_do_cc] [get_bd_ports C2C2B_aurora_do_cc]
connect_bd_net [get_bd_ports C2C2B_aurora_pma_init_in] [get_bd_pins C2C2B/aurora_pma_init_in]
connect_bd_net [get_bd_pins C2C2B/aurora_pma_init_out] [get_bd_pins C2C2B_PHY/pma_init]
connect_bd_net [get_bd_pins C2C2B/aurora_reset_pb] [get_bd_ports C2C2B_aurora_reset_pb] [get_bd_pins C2C2B_PHY/reset_pb]
connect_bd_net [get_bd_pins C2C2B/axi_c2c_config_error_out] [get_bd_ports C2C2B_axi_c2c_config_error_out]
connect_bd_net [get_bd_pins C2C2B/axi_c2c_link_error_out] [get_bd_ports C2C2B_axi_c2c_link_error_out]
connect_bd_net [get_bd_pins C2C2B/axi_c2c_link_status_out] [get_bd_ports C2C2B_axi_c2c_link_status_out]
connect_bd_net [get_bd_pins C2C2B/axi_c2c_multi_bit_error_out] [get_bd_ports C2C2B_axi_c2c_multi_bit_error_out]
connect_bd_net [get_bd_pins C2C2B/axi_c2c_s2m_intr_out] [get_bd_pins IRQ0_INTR_CTRL_IRQ/In3]
connect_bd_net [get_bd_pins C2C2_PHY/channel_up] [get_bd_ports C2C2_PHY_channel_up] [get_bd_pins C2C2/axi_c2c_aurora_channel_up]
connect_bd_net [get_bd_pins C2C2_PHY/gt_pll_lock] [get_bd_ports C2C2_PHY_gt_pll_lock]
connect_bd_net [get_bd_pins C2C2_PHY/hard_err] [get_bd_ports C2C2_PHY_hard_err]
connect_bd_net [get_bd_pins C2C2_PHY/lane_up] [get_bd_ports C2C2_PHY_lane_up]
connect_bd_net [get_bd_pins C2C2_PHY/link_reset_out] [get_bd_ports C2C2_PHY_link_reset_out]
connect_bd_net [get_bd_pins C2C2_PHY/mmcm_not_locked_out] [get_bd_ports C2C2_PHY_mmcm_not_locked_out] [get_bd_pins C2C2/aurora_mmcm_not_locked]
connect_bd_net [get_bd_ports C2C2_PHY_power_down] [get_bd_pins C2C2_PHY/power_down]
connect_bd_net [get_bd_ports C2C2_PHY_refclk] [get_bd_pins C2C2_PHY/refclk1_in]
connect_bd_net [get_bd_pins C2C2_PHY/soft_err] [get_bd_ports C2C2_PHY_soft_err]
connect_bd_net [get_bd_pins C2C2_PHY/user_clk_out] [get_bd_pins C2C2/axi_c2c_phy_clk] [get_bd_ports C2C2_PHY_CLK]
connect_bd_net [get_bd_pins C2C2/aurora_do_cc] [get_bd_ports C2C2_aurora_do_cc]
connect_bd_net [get_bd_ports C2C2_aurora_pma_init_in] [get_bd_pins C2C2/aurora_pma_init_in]
connect_bd_net [get_bd_pins C2C2/aurora_pma_init_out] [get_bd_pins C2C2_PHY/pma_init]
connect_bd_net [get_bd_pins C2C2/aurora_reset_pb] [get_bd_ports C2C2_aurora_reset_pb] [get_bd_pins C2C2_PHY/reset_pb]
connect_bd_net [get_bd_pins C2C2/axi_c2c_config_error_out] [get_bd_ports C2C2_axi_c2c_config_error_out]
connect_bd_net [get_bd_pins C2C2/axi_c2c_link_error_out] [get_bd_ports C2C2_axi_c2c_link_error_out]
connect_bd_net [get_bd_pins C2C2/axi_c2c_link_status_out] [get_bd_ports C2C2_axi_c2c_link_status_out]
connect_bd_net [get_bd_pins C2C2/axi_c2c_multi_bit_error_out] [get_bd_ports C2C2_axi_c2c_multi_bit_error_out]
connect_bd_net [get_bd_pins C2C2/axi_c2c_s2m_intr_out] [get_bd_pins IRQ0_INTR_CTRL_IRQ/In2]
connect_bd_net [get_bd_pins CM1_PB_UART/interrupt] [get_bd_pins IRQ0_INTR_CTRL_IRQ/In7]
connect_bd_net [get_bd_pins CM1_UART/interrupt] [get_bd_pins IRQ0_INTR_CTRL_IRQ/In5]
connect_bd_net [get_bd_pins CM2_PB_UART/interrupt] [get_bd_pins IRQ0_INTR_CTRL_IRQ/In8]
connect_bd_net [get_bd_pins CM2_UART/interrupt] [get_bd_pins IRQ0_INTR_CTRL_IRQ/In6]
connect_bd_net [get_bd_pins ESM_UART/interrupt] [get_bd_pins IRQ0_INTR_CTRL_IRQ/In9]
connect_bd_net [get_bd_ports INIT_CLK] \
  [get_bd_pins C2C1_PHY/init_clk] [get_bd_pins C2C1/aurora_init_clk] [get_bd_pins C2C1B_PHY/init_clk] \
  [get_bd_pins C2C1B/aurora_init_clk] [get_bd_pins C2C2_PHY/init_clk] [get_bd_pins C2C2/aurora_init_clk] \
  [get_bd_pins C2C2B_PHY/init_clk] [get_bd_pins C2C2B/aurora_init_clk]
connect_bd_net [get_bd_pins IRQ0_INTR_CTRL_IRQ/dout] [get_bd_pins IRQ0_INTR_CTRL/intr]
connect_bd_net [get_bd_pins IRQ0_INTR_CTRL/irq] [get_bd_pins ZynqMPSoC/pl_ps_irq0]
connect_bd_net [get_bd_pins MONITOR/alarm_out] [get_bd_ports MONITOR_alarm]
connect_bd_net [get_bd_pins MONITOR/ot_out] [get_bd_ports MONITOR_overtemp_alarm]
connect_bd_net [get_bd_pins MONITOR/vccaux_alarm_out] [get_bd_ports MONITOR_vccaux_alarm]
connect_bd_net [get_bd_pins MONITOR/vccint_alarm_out] [get_bd_ports MONITOR_vccint_alarm]
connect_bd_net [get_bd_pins SI/iic2intc_irpt] [get_bd_pins IRQ0_INTR_CTRL_IRQ/In4]
connect_bd_net [get_bd_ports SI_scl_i] [get_bd_pins SI/scl_i]
connect_bd_net [get_bd_pins SI/scl_o] [get_bd_ports SI_scl_o]
connect_bd_net [get_bd_pins SI/scl_t] [get_bd_ports SI_scl_t]
connect_bd_net [get_bd_ports SI_sda_i] [get_bd_pins SI/sda_i]
connect_bd_net [get_bd_pins SI/sda_o] [get_bd_ports SI_sda_o]
connect_bd_net [get_bd_pins SI/sda_t] [get_bd_ports SI_sda_t]
connect_bd_net [get_bd_pins SYS_RESET_BUS_RST_N/Res] [get_bd_ports SYS_RESET_bus_rst_n]
connect_bd_net [get_bd_pins SYS_RESET/bus_struct_reset] [get_bd_pins SYS_RESET_BUS_RST_N/Op1]
connect_bd_net [get_bd_pins SYS_RESET/interconnect_aresetn] [get_bd_ports SYS_RESET_intcn_rst_n]
connect_bd_net [get_bd_pins SYS_RESET/peripheral_aresetn] [get_bd_ports SYS_RESET_rst_n]
connect_bd_net [get_bd_pins ZynqMPSoC/pl_clk0] [get_bd_pins DMA_JTAG/s_axis_aclk]
